# Altium project Time4CM4_Modular.PrjPcb
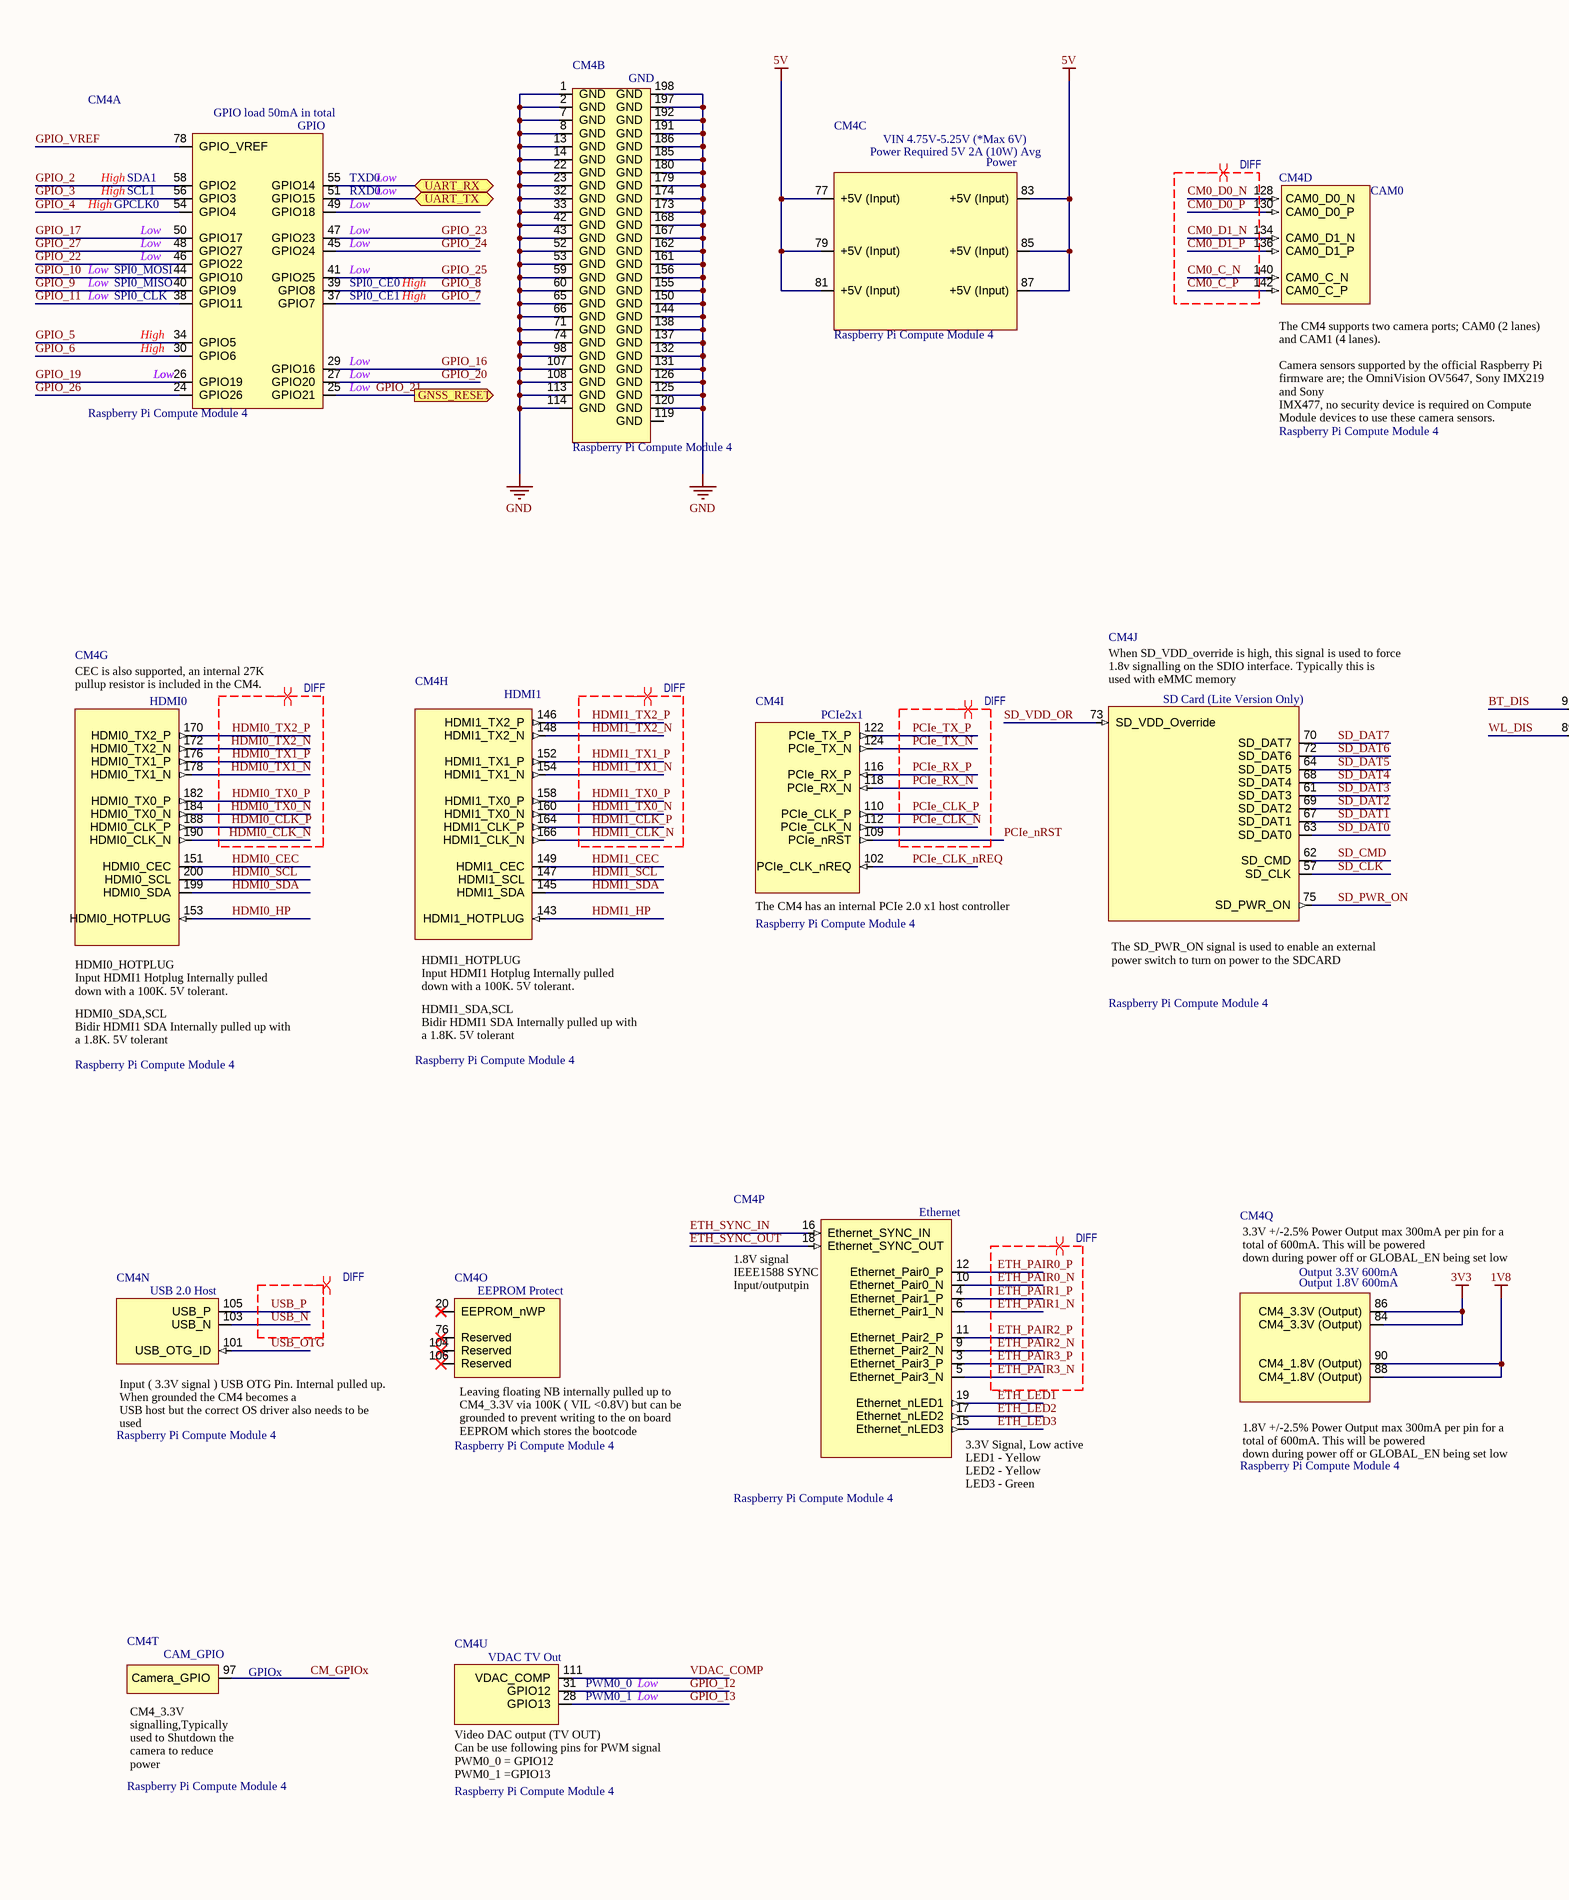
[diagram p0: CM4_Conn.SchDoc, left]
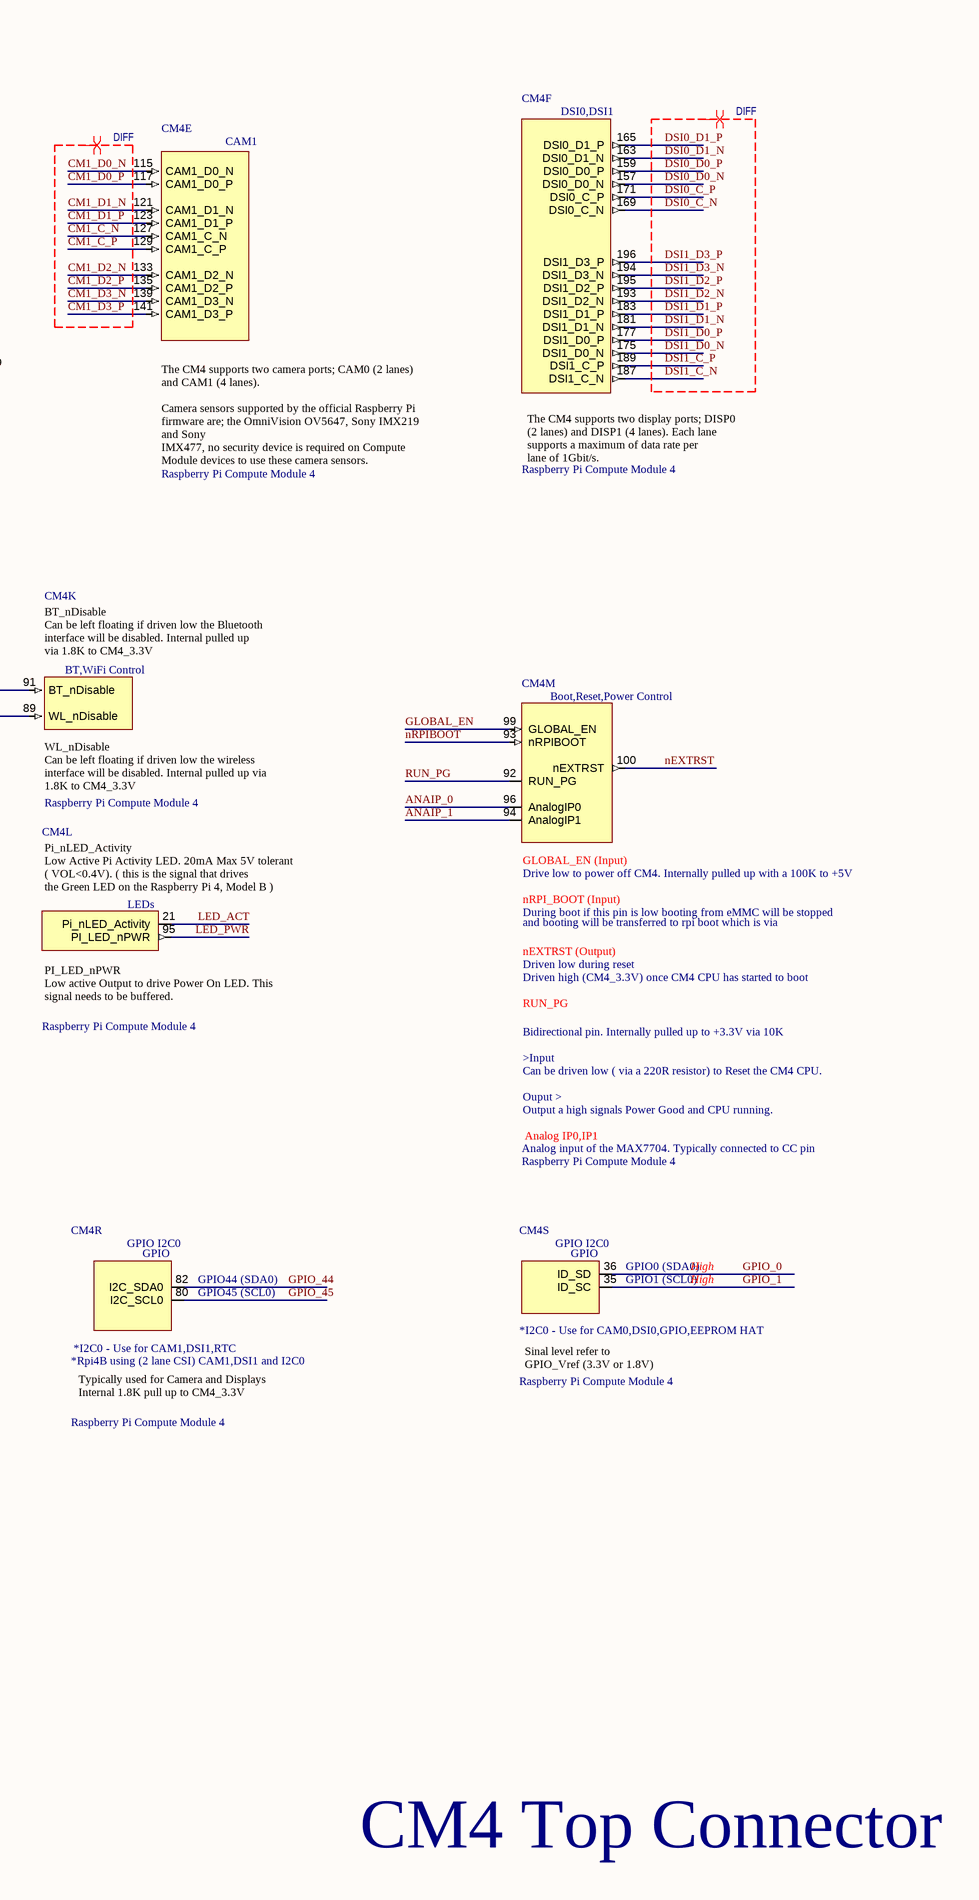
[diagram p1: CM4_Conn.SchDoc, right]
4 sheets, 35 parts. Net scope: global (net labels, ports and power ports of the same name join across sheets).
Board file: Time4CM4_Modular.PcbDoc
Sheets:
  CM4_Conn.SchDoc
  CM4_IO_Conn.SchDoc
  Modular_BO.SchDoc
  GNSS.SchDoc

## Sheet CM4_Conn.SchDoc
size C; SheetNumber: 1; SheetTotal: 4

### Parts
CM4  Raspberry Pi Compute Module 4  [CM4-F40C-100DS-0.4v_1.5mm_0mm]  (parts A,B,C,D,E,F,G,H,I,J,K,L,M,N,O,P,Q,R,S,T,U of 21)  (no BOM)

### Ports
GNSS_RESET (out), UART_RX (bidir), UART_TX (bidir)

### Nets
1V8: CM4.88(CM4_1.8V_(Output)) CM4.90(CM4_1.8V_(Output))
3V3: CM4.84(CM4_3.3V_(Output)) CM4.86(CM4_3.3V_(Output))
5V: CM4.77(+5V_(Input)) CM4.79(+5V_(Input)) CM4.81(+5V_(Input)) CM4.83(+5V_(Input)) CM4.85(+5V_(Input)) CM4.87(+5V_(Input))
GND: CM4.1(GND) CM4.2(GND) CM4.7(GND) CM4.8(GND) CM4.13(GND) CM4.14(GND) CM4.22(GND) CM4.23(GND) CM4.32(GND) CM4.33(GND) CM4.42(GND) CM4.43(GND) CM4.52(GND) CM4.53(GND) CM4.59(GND) CM4.60(GND) CM4.65(GND) CM4.66(GND) CM4.71(GND) CM4.74(GND) CM4.98(GND) CM4.107(GND) CM4.108(GND) CM4.113(GND) CM4.114(GND) CM4.120(GND) CM4.125(GND) CM4.126(GND) CM4.131(GND) CM4.132(GND) CM4.137(GND) CM4.138(GND) CM4.144(GND) CM4.150(GND) CM4.155(GND) CM4.156(GND) CM4.161(GND) CM4.162(GND) CM4.167(GND) CM4.168(GND) CM4.173(GND) CM4.174(GND) CM4.179(GND) CM4.180(GND) CM4.185(GND) CM4.186(GND) CM4.191(GND) CM4.192(GND) CM4.197(GND) CM4.198(GND)
ANAIP_0: CM4.96(AnalogIP0)
ANAIP_1: CM4.94(AnalogIP1)
BT_DIS: CM4.91(BT_nDisable)
CM0_C_N: CM4.140(CAM0_C_N)
CM0_C_P: CM4.142(CAM0_C_P)
CM0_D0_N: CM4.128(CAM0_D0_N)
CM0_D0_P: CM4.130(CAM0_D0_P)
CM0_D1_N: CM4.134(CAM0_D1_N)
CM0_D1_P: CM4.136(CAM0_D1_P)
CM1_C_N: CM4.127(CAM1_C_N)
CM1_C_P: CM4.129(CAM1_C_P)
CM1_D0_N: CM4.115(CAM1_D0_N)
CM1_D0_P: CM4.117(CAM1_D0_P)
CM1_D1_N: CM4.121(CAM1_D1_N)
CM1_D1_P: CM4.123(CAM1_D1_P)
CM1_D2_N: CM4.133(CAM1_D2_N)
CM1_D2_P: CM4.135(CAM1_D2_P)
CM1_D3_N: CM4.139(CAM1_D3_N)
CM1_D3_P: CM4.141(CAM1_D3_P)
CM_GPIOx: CM4.97(Camera_GPIO)
DSI0_C_N: CM4.169(DSI0_C_N)
DSI0_C_P: CM4.171(DSI0_C_P)
DSI0_D0_N: CM4.157(DSI0_D0_N)
DSI0_D0_P: CM4.159(DSI0_D0_P)
DSI0_D1_N: CM4.163(DSI0_D1_N)
DSI0_D1_P: CM4.165(DSI0_D1_P)
DSI1_C_N: CM4.187(DSI1_C_N)
DSI1_C_P: CM4.189(DSI1_C_P)
DSI1_D0_N: CM4.175(DSI1_D0_N)
DSI1_D0_P: CM4.177(DSI1_D0_P)
DSI1_D1_N: CM4.181(DSI1_D1_N)
DSI1_D1_P: CM4.183(DSI1_D1_P)
DSI1_D2_N: CM4.193(DSI1_D2_N)
DSI1_D2_P: CM4.195(DSI1_D2_P)
DSI1_D3_N: CM4.194(DSI1_D3_N)
DSI1_D3_P: CM4.196(DSI1_D3_P)
ETH_LED1: CM4.19(Ethernet_nLED1)
ETH_LED2: CM4.17(Ethernet_nLED2)
ETH_LED3: CM4.15(Ethernet_nLED3)
ETH_PAIR0_N: CM4.10(Ethernet_Pair0_N)
ETH_PAIR0_P: CM4.12(Ethernet_Pair0_P)
ETH_PAIR1_N: CM4.6(Ethernet_Pair1_N)
ETH_PAIR1_P: CM4.4(Ethernet_Pair1_P)
ETH_PAIR2_N: CM4.9(Ethernet_Pair2_N)
ETH_PAIR2_P: CM4.11(Ethernet_Pair2_P)
ETH_PAIR3_N: CM4.5(Ethernet_Pair3_N)
ETH_PAIR3_P: CM4.3(Ethernet_Pair3_P)
ETH_SYNC_IN: CM4.16(Ethernet_SYNC_IN)
ETH_SYNC_OUT: CM4.18(Ethernet_SYNC_OUT)
GLOBAL_EN: CM4.99(GLOBAL_EN)
GPIO_0: CM4.36(ID_SD)
GPIO_1: CM4.35(ID_SC)
GPIO_2: CM4.58(GPIO2)
GPIO_3: CM4.56(GPIO3)
GPIO_4: CM4.54(GPIO4)
GPIO_5: CM4.34(GPIO5)
GPIO_6: CM4.30(GPIO6)
GPIO_7: CM4.37(GPIO7)
GPIO_8: CM4.39(GPIO8)
GPIO_9: CM4.40(GPIO9)
GPIO_10: CM4.44(GPIO10)
GPIO_11: CM4.38(GPIO11)
GPIO_12: CM4.31(GPIO12)
GPIO_13: CM4.28(GPIO13)
GPIO_16: CM4.29(GPIO16)
GPIO_17: CM4.50(GPIO17)
GPIO_19: CM4.26(GPIO19)
GPIO_20: CM4.27(GPIO20)
GPIO_21: CM4.25(GPIO21) ; port GNSS_RESET  [project net GNSS_RESET]
GPIO_22: CM4.46(GPIO22)
GPIO_23: CM4.47(GPIO23)
GPIO_24: CM4.45(GPIO24)
GPIO_25: CM4.41(GPIO25)
GPIO_26: CM4.24(GPIO26)
GPIO_27: CM4.48(GPIO27)
GPIO_44: CM4.82(I2C_SDA0)
GPIO_45: CM4.80(I2C_SCL0)
GPIO_VREF: CM4.78(GPIO_VREF)
HDMI0_CEC: CM4.151(HDMI0_CEC)
HDMI0_CLK_N: CM4.190(HDMI0_CLK_N)
HDMI0_CLK_P: CM4.188(HDMI0_CLK_P)
HDMI0_HP: CM4.153(HDMI0_HOTPLUG)
HDMI0_SCL: CM4.200(HDMI0_SCL)
HDMI0_SDA: CM4.199(HDMI0_SDA)
HDMI0_TX0_N: CM4.184(HDMI0_TX0_N)
HDMI0_TX0_P: CM4.182(HDMI0_TX0_P)
HDMI0_TX1_N: CM4.178(HDMI0_TX1_N)
HDMI0_TX1_P: CM4.176(HDMI0_TX1_P)
HDMI0_TX2_N: CM4.172(HDMI0_TX2_N)
HDMI0_TX2_P: CM4.170(HDMI0_TX2_P)
HDMI1_CEC: CM4.149(HDMI1_CEC)
HDMI1_CLK_N: CM4.166(HDMI1_CLK_N)
HDMI1_CLK_P: CM4.164(HDMI1_CLK_P)
HDMI1_HP: CM4.143(HDMI1_HOTPLUG)
HDMI1_SCL: CM4.147(HDMI1_SCL)
HDMI1_SDA: CM4.145(HDMI1_SDA)
HDMI1_TX0_N: CM4.160(HDMI1_TX0_N)
HDMI1_TX0_P: CM4.158(HDMI1_TX0_P)
HDMI1_TX1_N: CM4.154(HDMI1_TX1_N)
HDMI1_TX1_P: CM4.152(HDMI1_TX1_P)
HDMI1_TX2_N: CM4.148(HDMI1_TX2_N)
HDMI1_TX2_P: CM4.146(HDMI1_TX2_P)
LED_ACT: CM4.21(Pi_nLED_Activity)
LED_PWR: CM4.95(PI_LED_nPWR)
nEXTRST: CM4.100(nEXTRST)
nRPIBOOT: CM4.93(nRPIBOOT)
PCIe_CLK_N: CM4.112(PCIe_CLK_N)
PCIe_CLK_nREQ: CM4.102(PCIe_CLK_nREQ)
PCIe_CLK_P: CM4.110(PCIe_CLK_P)
PCIe_nRST: CM4.109(PCIe_nRST)
PCIe_RX_N: CM4.118(PCIe_RX_N)
PCIe_RX_P: CM4.116(PCIe_RX_P)
PCIe_TX_N: CM4.124(PCIe_TX_N)
PCIe_TX_P: CM4.122(PCIe_TX_P)
RUN_PG: CM4.92(RUN_PG)
SD_CLK: CM4.57(SD_CLK)
SD_CMD: CM4.62(SD_CMD)
SD_DAT0: CM4.63(SD_DAT0)
SD_DAT1: CM4.67(SD_DAT1)
SD_DAT2: CM4.69(SD_DAT2)
SD_DAT3: CM4.61(SD_DAT3)
SD_DAT4: CM4.68(SD_DAT4)
SD_DAT5: CM4.64(SD_DAT5)
SD_DAT6: CM4.72(SD_DAT6)
SD_DAT7: CM4.70(SD_DAT7)
SD_PWR_ON: CM4.75(SD_PWR_ON)
SD_VDD_OR: CM4.73(SD_VDD_Override)
UART_RX: CM4.55(GPIO14) ; port UART_RX
UART_TX: CM4.51(GPIO15) ; port UART_TX
USB_N: CM4.103(USB_N)
USB_OTG: CM4.101(USB_OTG_ID)
USB_P: CM4.105(USB_P)
VDAC_COMP: CM4.111(VDAC_COMP)
WL_DIS: CM4.89(WL_nDisable)

Not connected (* = marked no-connect by the designer): CM4 20(EEPROM_nWP)* 49(GPIO18) 76(Reserved)* 104(Reserved)* 106(Reserved)* 119(GND)

### Layout directives
differential pair; differential pair class DIFF: CM0_C_N, CM0_C_P, CM0_D0_N, CM0_D0_P, CM0_D1_N, CM0_D1_P, CM1_C_N, CM1_C_P, CM1_D0_N, CM1_D0_P, CM1_D1_N, CM1_D1_P, CM1_D2_N, CM1_D2_P, CM1_D3_N, CM1_D3_P, DSI0_C_N, DSI0_C_P, DSI0_D0_N, DSI0_D0_P, DSI0_D1_N, DSI0_D1_P, DSI1_C_N, DSI1_C_P, DSI1_D0_N, DSI1_D0_P, DSI1_D1_N, DSI1_D1_P, DSI1_D2_N, DSI1_D2_P, DSI1_D3_N, DSI1_D3_P, ETH_PAIR0_N, ETH_PAIR0_P, ETH_PAIR1_N, ETH_PAIR1_P, ETH_PAIR2_N, ETH_PAIR2_P, ETH_PAIR3_N, ETH_PAIR3_P, HDMI0_CLK_N, HDMI0_CLK_P, HDMI0_TX0_N, HDMI0_TX0_P, HDMI0_TX1_N, HDMI0_TX1_P, HDMI0_TX2_N, HDMI0_TX2_P, HDMI1_CLK_N, HDMI1_CLK_P, HDMI1_TX0_N, HDMI1_TX0_P, HDMI1_TX1_N, HDMI1_TX1_P, HDMI1_TX2_N, HDMI1_TX2_P, PCIe_CLK_N, PCIe_CLK_P, PCIe_RX_N, PCIe_RX_P, PCIe_TX_N, PCIe_TX_P, USB_N, USB_P

### Notes on the sheet
- CM4 Top Connector
- DWG. NO.
- REV.
- SHT.
- REVISION
- DESCRIPTION
- DATE
- APPROVED
- THIS DOCUMENT AND THE DATA DISCLOSED HEREIN OR HEREWITH IS THE PROPERTY OF ALTIUM LIMITED AND MAY BE FREELY DISTRIBUTED IN WHOLE. NO RIGHTS ARE RESERVED OR EXPRESS OR IMPLIED WARANTEE GIVEN.
- ENG:
- DSN:
- APPROVALS
- PROJECT
- DOCUMENT REVISION:
- DESIGN ITEM:
- CHK:
- BOM:
- REFERENCE DOCUMENTS
- PROJECT REVISION:
- TITLE
- FAB DWG:
- PCB DWG:
- ASSY DWG:
- SCALE:
- SIZE
- C
- CAGE CODE
- FILE NAME
- DWG NO.
- SHEET
- OF
- REV
- (in symbol CM4, part A) GPIO load 50mA in total; GPIO; High; SDA1; TXD0; Low; SCL1; RXD0; GPCLK0; SPI0_MOSI; SPI0_MISO; SPI0_CE0; SPI0_CLK; SPI0_CE1; by Amornthep Phunsin
- (in symbol CM4, part C) VIN 4.75V-5.25V (*Max 6V); Power Required 5V 2A (10W) Avg; Power; by Amornthep Phunsin
- (in symbol CM4, part D) CAM0; The CM4 supports two camera ports; CAM0 (2 lanes) and CAM1 (4 lanes). / Camera sensors supported by the official Raspberry Pi firmware are; the OmniVision OV5647, Sony IMX219 and Sony / IMX477, no security device is required on Compute Module devices to use these camera sensors.
- (in symbol CM4, part E) CAM1; The CM4 supports two camera ports; CAM0 (2 lanes) and CAM1 (4 lanes). / Camera sensors supported by the official Raspberry Pi firmware are; the OmniVision OV5647, Sony IMX219 and Sony / IMX477, no security device is required on Compute Module devices to use these camera sensors.
- (in symbol CM4, part F) DSI0,DSI1; The CM4 supports two display ports; DISP0 (2 lanes) and DISP1 (4 lanes). Each lane supports a maximum of data rate per / lane of 1Gbit/s.
- (in symbol CM4, part G) HDMI0; CEC is also supported, an internal 27K pullup resistor is included in the CM4.; HDMI0_HOTPLUG / Input HDMI1 Hotplug Internally pulled down with a 100K. 5V tolerant.; HDMI0_SDA,SCL / Bidir HDMI1 SDA Internally pulled up with a 1.8K. 5V tolerant
- (in symbol CM4, part H) HDMI1; HDMI1_HOTPLUG / Input HDMI1 Hotplug Internally pulled down with a 100K. 5V tolerant.; HDMI1_SDA,SCL / Bidir HDMI1 SDA Internally pulled up with a 1.8K. 5V tolerant
- (in symbol CM4, part I) PCIe2x1; The CM4 has an internal PCIe 2.0 x1 host controller
- (in symbol CM4, part J) When SD_VDD_override is high, this signal is used to force 1.8v signalling on the SDIO interface. Typically this is / used with eMMC memory; SD Card (Lite Version Only); by Amornthep Phunsin; The SD_PWR_ON signal is used to enable an external power switch to turn on power to the SDCARD
- (in symbol CM4, part K) BT_nDisable / Can be left floating if driven low the Bluetooth interface will be disabled. Internal pulled up / via 1.8K to CM4_3.3V; BT,WiFi Control; WL_nDisable / Can be left floating if driven low the wireless interface will be disabled. Internal pulled up via / 1.8K to CM4_3.3V
- (in symbol CM4, part L) Pi_nLED_Activity / Low Active Pi Activity LED. 20mA Max 5V tolerant ( VOL<0.4V). ( this is the signal that drives / the Green LED on the Raspberry Pi 4, Model B ); LEDs; PI_LED_nPWR / Low active Output to drive Power On LED. This signal needs to be buffered.
- (in symbol CM4, part M) Boot,Reset,Power Control; GLOBAL_EN (Input); Drive low to power off CM4. Internally pulled up with a 100K to +5V; nRPI_BOOT (Input); During boot if this pin is low booting from eMMC will be stopped; and booting will be transferred to rpi boot which is via; nEXTRST (Output); Driven low during reset; Driven high (CM4_3.3V) once CM4 CPU has started to boot; Bidirectional pin. Internally pulled up to +3.3V via 10K / >Input / Can be driven low ( via a 220R resistor) to Reset the CM4 CPU. / Ouput > / Output a high signals Power Good and CPU running.; Analog IP0,IP1; Analog input of the MAX7704. Typically connected to CC pin
- (in symbol CM4, part N) USB 2.0 Host; Input ( 3.3V signal ) USB OTG Pin. Internal pulled up. When grounded the CM4 becomes a / USB host but the correct OS driver also needs to be used
- (in symbol CM4, part O) EEPROM Protect; Leaving floating NB internally pulled up to CM4_3.3V via 100K ( VIL <0.8V) but can be / grounded to prevent writing to the on board EEPROM which stores the bootcode
- (in symbol CM4, part P) Ethernet; 1.8V signal / IEEE1588 SYNC Input/outputpin; by Amornthep Phunsin; 3.3V Signal, Low active / LED1 - Yellow / LED2 - Yellow / LED3 - Green
- (in symbol CM4, part Q) 3.3V +/-2.5% Power Output max 300mA per pin for a total of 600mA. This will be powered / down during power off or GLOBAL_EN being set low; Output 3.3V 600mA; Output 1.8V 600mA; 1.8V +/-2.5% Power Output max 300mA per pin for a total of 600mA. This will be powered / down during power off or GLOBAL_EN being set low
- (in symbol CM4, part R) GPIO I2C0; GPIO; GPIO44 (SDA0); GPIO45 (SCL0); *I2C0 - Use for CAM1,DSI1,RTC; *Rpi4B using (2 lane CSI) CAM1,DSI1 and I2C0; Typically used for Camera and Displays Internal 1.8K pull up to CM4_3.3V
- (in symbol CM4, part S) GPIO I2C0; GPIO; GPIO0 (SDA0); High; GPIO1 (SCL0); *I2C0 - Use for CAM0,DSI0,GPIO,EEPROM HAT; Sinal level refer to  GPIO_Vref (3.3V or 1.8V)
- (in symbol CM4, part T) CAM_GPIO; GPIOx; CM4_3.3V signalling,Typically used to Shutdown the camera to reduce power
- (in symbol CM4, part U) VDAC TV Out; PWM0_0; Low; PWM0_1; Video DAC output (TV OUT) / Can be use following pins for PWM signal / PWM0_0 = GPIO12 / PWM0_1 =GPIO13

### Library data of the parts
CM4 = CM4: Raspberry Pi Compute Module 4 by Amornthep Phunsin

## Sheet CM4_IO_Conn.SchDoc
size C; SheetNumber: 2; SheetTotal: 4
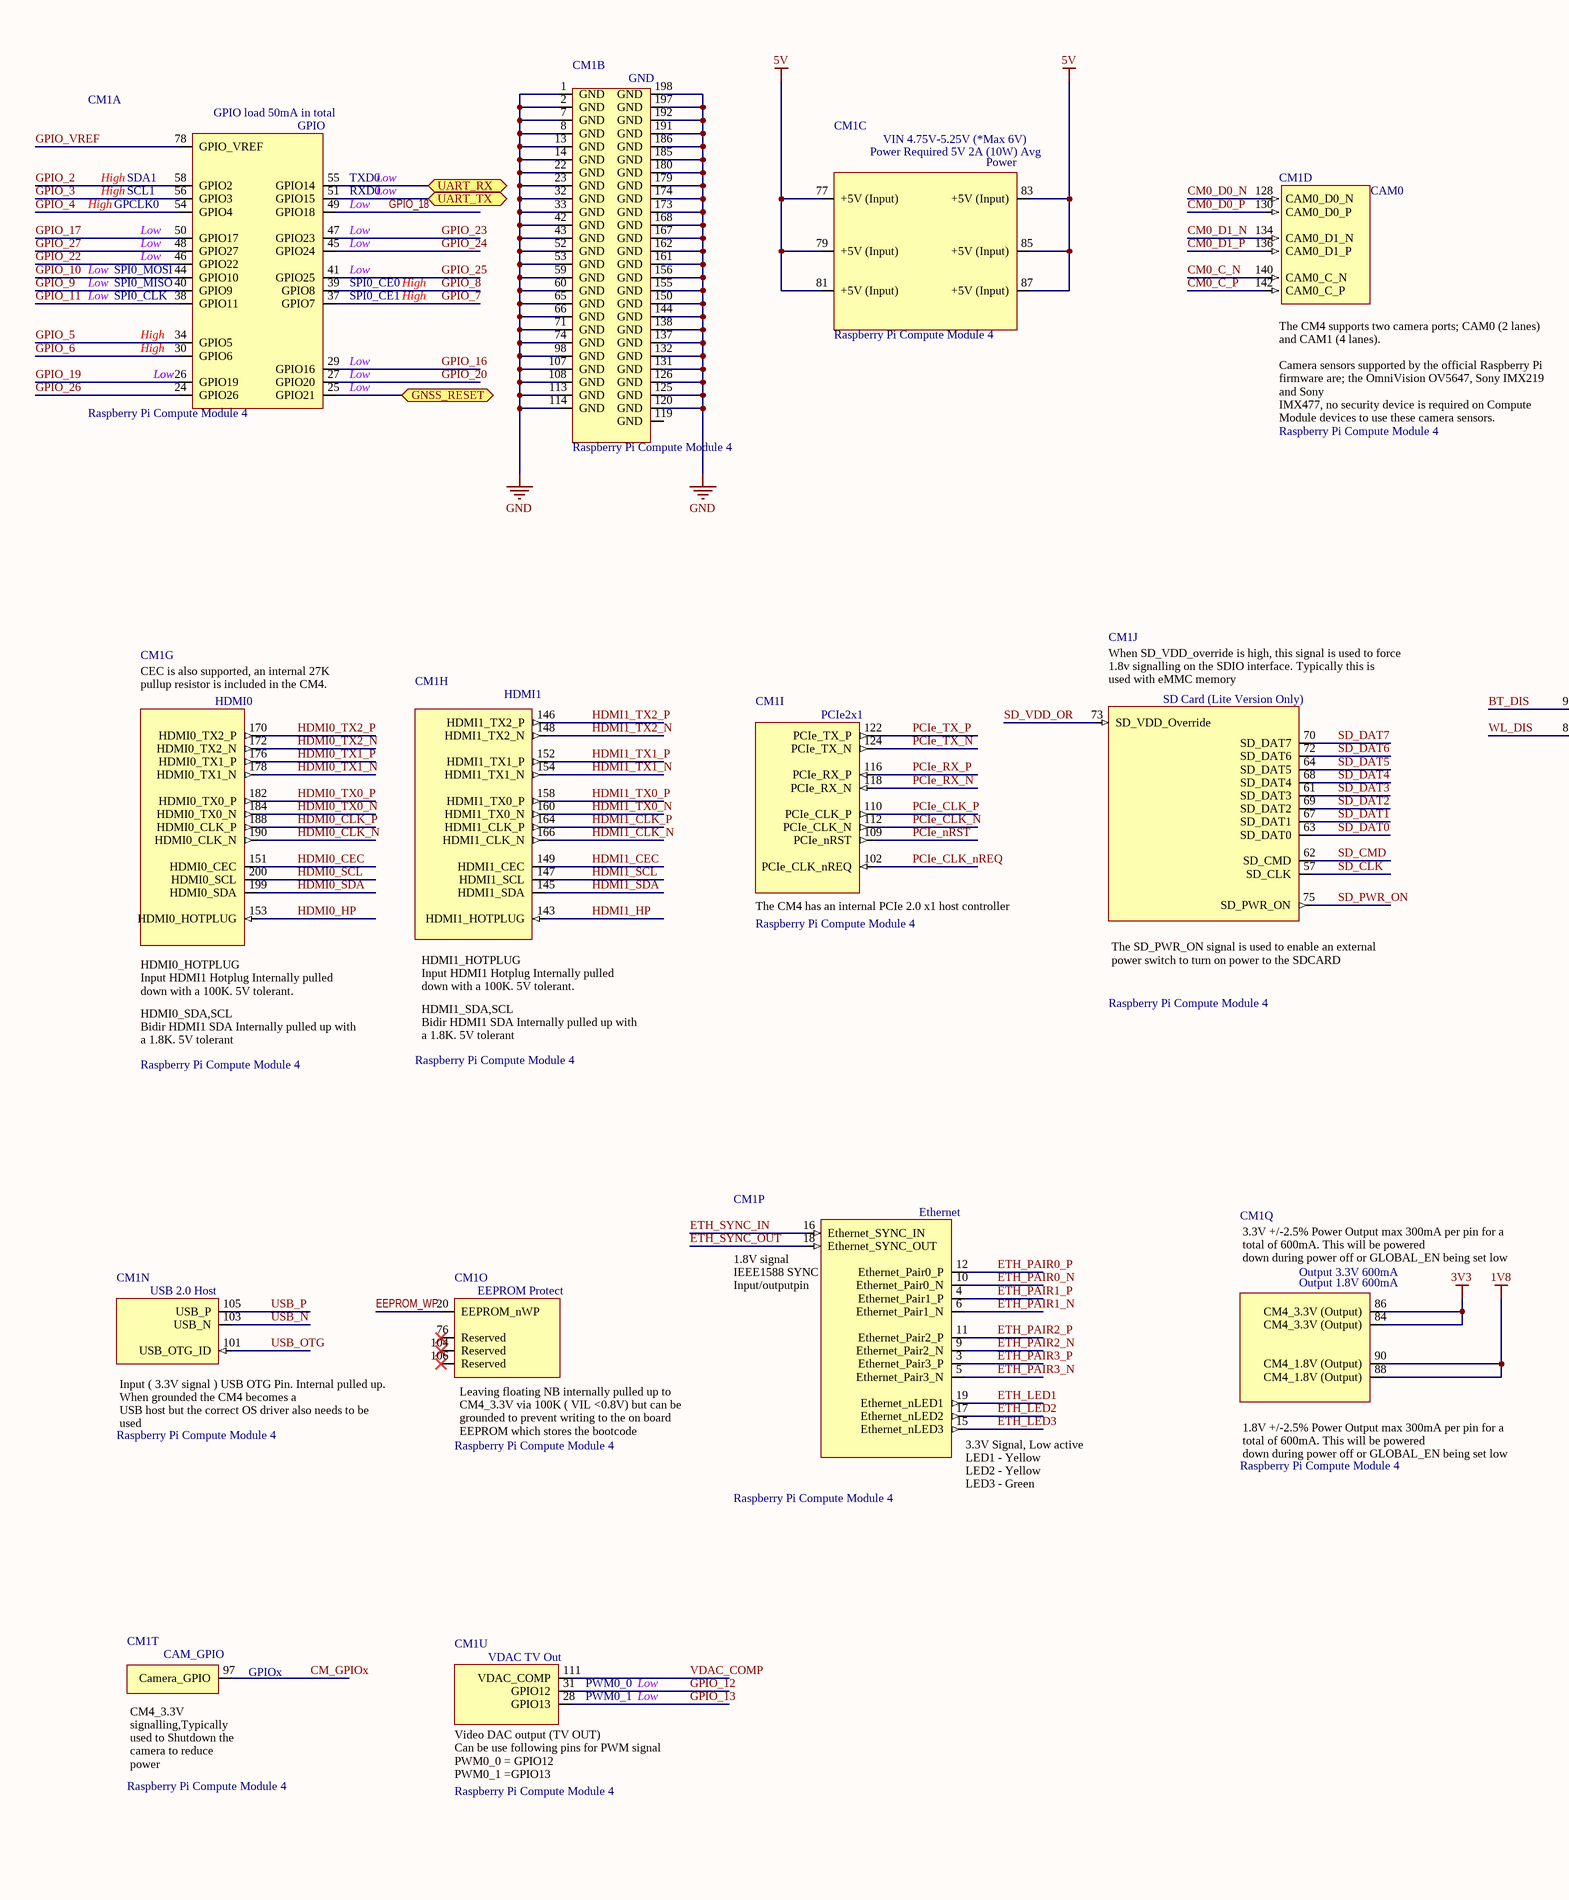
[diagram p2: CM4_IO_Conn.SchDoc, left]
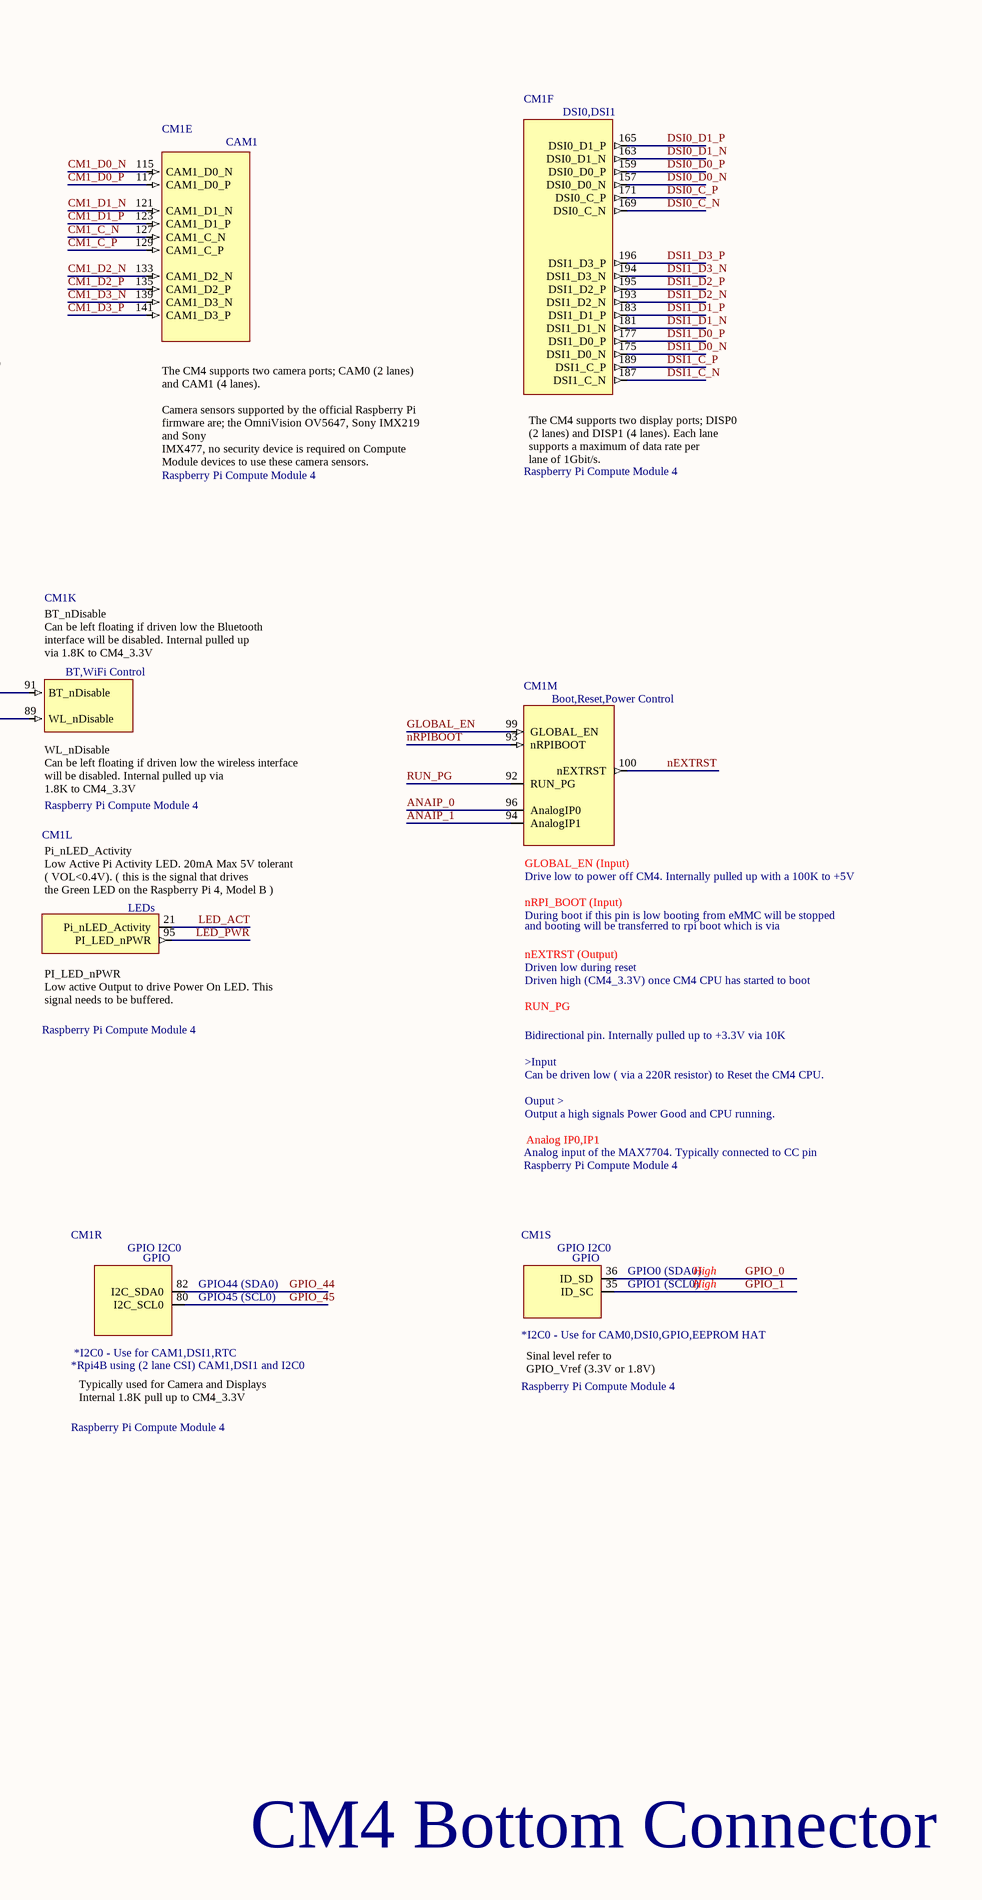
[diagram p3: CM4_IO_Conn.SchDoc, right]

### Parts
CM1  Raspberry Pi Compute Module 4  [CM4-F40C-100DS-0.4v_1.5mm_0mm]  (parts A,B,C,D,E,F,G,H,I,J,K,L,M,N,O,P,Q,R,S,T,U of 21)  (no BOM)

### Ports
GNSS_RESET (bidir), UART_RX (bidir), UART_TX (bidir)

### Nets
1V8: CM1.88(CM4_1.8V_(Output)) CM1.90(CM4_1.8V_(Output))
3V3: CM1.84(CM4_3.3V_(Output)) CM1.86(CM4_3.3V_(Output))
5V: CM1.77(+5V_(Input)) CM1.79(+5V_(Input)) CM1.81(+5V_(Input)) CM1.83(+5V_(Input)) CM1.85(+5V_(Input)) CM1.87(+5V_(Input))
GND: CM1.1(GND) CM1.2(GND) CM1.7(GND) CM1.8(GND) CM1.13(GND) CM1.14(GND) CM1.22(GND) CM1.23(GND) CM1.32(GND) CM1.33(GND) CM1.42(GND) CM1.43(GND) CM1.52(GND) CM1.53(GND) CM1.59(GND) CM1.60(GND) CM1.65(GND) CM1.66(GND) CM1.71(GND) CM1.74(GND) CM1.98(GND) CM1.107(GND) CM1.108(GND) CM1.113(GND) CM1.114(GND) CM1.120(GND) CM1.125(GND) CM1.126(GND) CM1.131(GND) CM1.132(GND) CM1.137(GND) CM1.138(GND) CM1.144(GND) CM1.150(GND) CM1.155(GND) CM1.156(GND) CM1.161(GND) CM1.162(GND) CM1.167(GND) CM1.168(GND) CM1.173(GND) CM1.174(GND) CM1.179(GND) CM1.180(GND) CM1.185(GND) CM1.186(GND) CM1.191(GND) CM1.192(GND) CM1.197(GND) CM1.198(GND)
ANAIP_0: CM1.96(AnalogIP0)
ANAIP_1: CM1.94(AnalogIP1)
BT_DIS: CM1.91(BT_nDisable)
CM0_C_N: CM1.140(CAM0_C_N)
CM0_C_P: CM1.142(CAM0_C_P)
CM0_D0_N: CM1.128(CAM0_D0_N)
CM0_D0_P: CM1.130(CAM0_D0_P)
CM0_D1_N: CM1.134(CAM0_D1_N)
CM0_D1_P: CM1.136(CAM0_D1_P)
CM1_C_N: CM1.127(CAM1_C_N)
CM1_C_P: CM1.129(CAM1_C_P)
CM1_D0_N: CM1.115(CAM1_D0_N)
CM1_D0_P: CM1.117(CAM1_D0_P)
CM1_D1_N: CM1.121(CAM1_D1_N)
CM1_D1_P: CM1.123(CAM1_D1_P)
CM1_D2_N: CM1.133(CAM1_D2_N)
CM1_D2_P: CM1.135(CAM1_D2_P)
CM1_D3_N: CM1.139(CAM1_D3_N)
CM1_D3_P: CM1.141(CAM1_D3_P)
CM_GPIOx: CM1.97(Camera_GPIO)
DSI0_C_N: CM1.169(DSI0_C_N)
DSI0_C_P: CM1.171(DSI0_C_P)
DSI0_D0_N: CM1.157(DSI0_D0_N)
DSI0_D0_P: CM1.159(DSI0_D0_P)
DSI0_D1_N: CM1.163(DSI0_D1_N)
DSI0_D1_P: CM1.165(DSI0_D1_P)
DSI1_C_N: CM1.187(DSI1_C_N)
DSI1_C_P: CM1.189(DSI1_C_P)
DSI1_D0_N: CM1.175(DSI1_D0_N)
DSI1_D0_P: CM1.177(DSI1_D0_P)
DSI1_D1_N: CM1.181(DSI1_D1_N)
DSI1_D1_P: CM1.183(DSI1_D1_P)
DSI1_D2_N: CM1.193(DSI1_D2_N)
DSI1_D2_P: CM1.195(DSI1_D2_P)
DSI1_D3_N: CM1.194(DSI1_D3_N)
DSI1_D3_P: CM1.196(DSI1_D3_P)
EEPROM_WP: CM1.20(EEPROM_nWP)
ETH_LED1: CM1.19(Ethernet_nLED1)
ETH_LED2: CM1.17(Ethernet_nLED2)
ETH_LED3: CM1.15(Ethernet_nLED3)
ETH_PAIR0_N: CM1.10(Ethernet_Pair0_N)
ETH_PAIR0_P: CM1.12(Ethernet_Pair0_P)
ETH_PAIR1_N: CM1.6(Ethernet_Pair1_N)
ETH_PAIR1_P: CM1.4(Ethernet_Pair1_P)
ETH_PAIR2_N: CM1.9(Ethernet_Pair2_N)
ETH_PAIR2_P: CM1.11(Ethernet_Pair2_P)
ETH_PAIR3_N: CM1.5(Ethernet_Pair3_N)
ETH_PAIR3_P: CM1.3(Ethernet_Pair3_P)
ETH_SYNC_IN: CM1.16(Ethernet_SYNC_IN)
ETH_SYNC_OUT: CM1.18(Ethernet_SYNC_OUT)
GLOBAL_EN: CM1.99(GLOBAL_EN)
GNSS_RESET: CM1.25(GPIO21) ; port GNSS_RESET
GPIO_0: CM1.36(ID_SD)
GPIO_1: CM1.35(ID_SC)
GPIO_2: CM1.58(GPIO2)
GPIO_3: CM1.56(GPIO3)
GPIO_4: CM1.54(GPIO4)
GPIO_5: CM1.34(GPIO5)
GPIO_6: CM1.30(GPIO6)
GPIO_7: CM1.37(GPIO7)
GPIO_8: CM1.39(GPIO8)
GPIO_9: CM1.40(GPIO9)
GPIO_10: CM1.44(GPIO10)
GPIO_11: CM1.38(GPIO11)
GPIO_12: CM1.31(GPIO12)
GPIO_13: CM1.28(GPIO13)
GPIO_16: CM1.29(GPIO16)
GPIO_17: CM1.50(GPIO17)
GPIO_18: CM1.49(GPIO18)
GPIO_19: CM1.26(GPIO19)
GPIO_20: CM1.27(GPIO20)
GPIO_22: CM1.46(GPIO22)
GPIO_23: CM1.47(GPIO23)
GPIO_24: CM1.45(GPIO24)
GPIO_25: CM1.41(GPIO25)
GPIO_26: CM1.24(GPIO26)
GPIO_27: CM1.48(GPIO27)
GPIO_44: CM1.82(I2C_SDA0)
GPIO_45: CM1.80(I2C_SCL0)
GPIO_VREF: CM1.78(GPIO_VREF)
HDMI0_CEC: CM1.151(HDMI0_CEC)
HDMI0_CLK_N: CM1.190(HDMI0_CLK_N)
HDMI0_CLK_P: CM1.188(HDMI0_CLK_P)
HDMI0_HP: CM1.153(HDMI0_HOTPLUG)
HDMI0_SCL: CM1.200(HDMI0_SCL)
HDMI0_SDA: CM1.199(HDMI0_SDA)
HDMI0_TX0_N: CM1.184(HDMI0_TX0_N)
HDMI0_TX0_P: CM1.182(HDMI0_TX0_P)
HDMI0_TX1_N: CM1.178(HDMI0_TX1_N)
HDMI0_TX1_P: CM1.176(HDMI0_TX1_P)
HDMI0_TX2_N: CM1.172(HDMI0_TX2_N)
HDMI0_TX2_P: CM1.170(HDMI0_TX2_P)
HDMI1_CEC: CM1.149(HDMI1_CEC)
HDMI1_CLK_N: CM1.166(HDMI1_CLK_N)
HDMI1_CLK_P: CM1.164(HDMI1_CLK_P)
HDMI1_HP: CM1.143(HDMI1_HOTPLUG)
HDMI1_SCL: CM1.147(HDMI1_SCL)
HDMI1_SDA: CM1.145(HDMI1_SDA)
HDMI1_TX0_N: CM1.160(HDMI1_TX0_N)
HDMI1_TX0_P: CM1.158(HDMI1_TX0_P)
HDMI1_TX1_N: CM1.154(HDMI1_TX1_N)
HDMI1_TX1_P: CM1.152(HDMI1_TX1_P)
HDMI1_TX2_N: CM1.148(HDMI1_TX2_N)
HDMI1_TX2_P: CM1.146(HDMI1_TX2_P)
LED_ACT: CM1.21(Pi_nLED_Activity)
LED_PWR: CM1.95(PI_LED_nPWR)
nEXTRST: CM1.100(nEXTRST)
nRPIBOOT: CM1.93(nRPIBOOT)
PCIe_CLK_N: CM1.112(PCIe_CLK_N)
PCIe_CLK_nREQ: CM1.102(PCIe_CLK_nREQ)
PCIe_CLK_P: CM1.110(PCIe_CLK_P)
PCIe_nRST: CM1.109(PCIe_nRST)
PCIe_RX_N: CM1.118(PCIe_RX_N)
PCIe_RX_P: CM1.116(PCIe_RX_P)
PCIe_TX_N: CM1.124(PCIe_TX_N)
PCIe_TX_P: CM1.122(PCIe_TX_P)
RUN_PG: CM1.92(RUN_PG)
SD_CLK: CM1.57(SD_CLK)
SD_CMD: CM1.62(SD_CMD)
SD_DAT0: CM1.63(SD_DAT0)
SD_DAT1: CM1.67(SD_DAT1)
SD_DAT2: CM1.69(SD_DAT2)
SD_DAT3: CM1.61(SD_DAT3)
SD_DAT4: CM1.68(SD_DAT4)
SD_DAT5: CM1.64(SD_DAT5)
SD_DAT6: CM1.72(SD_DAT6)
SD_DAT7: CM1.70(SD_DAT7)
SD_PWR_ON: CM1.75(SD_PWR_ON)
SD_VDD_OR: CM1.73(SD_VDD_Override)
UART_RX: CM1.55(GPIO14) ; port UART_RX
UART_TX: CM1.51(GPIO15) ; port UART_TX
USB_N: CM1.103(USB_N)
USB_OTG: CM1.101(USB_OTG_ID)
USB_P: CM1.105(USB_P)
VDAC_COMP: CM1.111(VDAC_COMP)
WL_DIS: CM1.89(WL_nDisable)

Not connected (* = marked no-connect by the designer): CM1 76(Reserved)* 104(Reserved)* 106(Reserved)* 119(GND)

### Notes on the sheet
- CM4 Bottom Connector
- (in symbol CM4, part A) GPIO load 50mA in total; GPIO; High; SDA1; TXD0; Low; SCL1; RXD0; GPCLK0; SPI0_MOSI; SPI0_MISO; SPI0_CE0; SPI0_CLK; SPI0_CE1; by Amornthep Phunsin
- (in symbol CM4, part C) VIN 4.75V-5.25V (*Max 6V); Power Required 5V 2A (10W) Avg; Power; by Amornthep Phunsin
- (in symbol CM4, part D) CAM0; The CM4 supports two camera ports; CAM0 (2 lanes) and CAM1 (4 lanes). / Camera sensors supported by the official Raspberry Pi firmware are; the OmniVision OV5647, Sony IMX219 and Sony / IMX477, no security device is required on Compute Module devices to use these camera sensors.
- (in symbol CM4, part E) CAM1; The CM4 supports two camera ports; CAM0 (2 lanes) and CAM1 (4 lanes). / Camera sensors supported by the official Raspberry Pi firmware are; the OmniVision OV5647, Sony IMX219 and Sony / IMX477, no security device is required on Compute Module devices to use these camera sensors.
- (in symbol CM4, part F) DSI0,DSI1; The CM4 supports two display ports; DISP0 (2 lanes) and DISP1 (4 lanes). Each lane supports a maximum of data rate per / lane of 1Gbit/s.
- (in symbol CM4, part G) HDMI0; CEC is also supported, an internal 27K pullup resistor is included in the CM4.; HDMI0_HOTPLUG / Input HDMI1 Hotplug Internally pulled down with a 100K. 5V tolerant.; HDMI0_SDA,SCL / Bidir HDMI1 SDA Internally pulled up with a 1.8K. 5V tolerant
- (in symbol CM4, part H) HDMI1; HDMI1_HOTPLUG / Input HDMI1 Hotplug Internally pulled down with a 100K. 5V tolerant.; HDMI1_SDA,SCL / Bidir HDMI1 SDA Internally pulled up with a 1.8K. 5V tolerant
- (in symbol CM4, part I) PCIe2x1; The CM4 has an internal PCIe 2.0 x1 host controller
- (in symbol CM4, part J) When SD_VDD_override is high, this signal is used to force 1.8v signalling on the SDIO interface. Typically this is / used with eMMC memory; SD Card (Lite Version Only); by Amornthep Phunsin; The SD_PWR_ON signal is used to enable an external power switch to turn on power to the SDCARD
- (in symbol CM4, part K) BT_nDisable / Can be left floating if driven low the Bluetooth interface will be disabled. Internal pulled up / via 1.8K to CM4_3.3V; BT,WiFi Control; WL_nDisable / Can be left floating if driven low the wireless interface will be disabled. Internal pulled up via / 1.8K to CM4_3.3V
- (in symbol CM4, part L) Pi_nLED_Activity / Low Active Pi Activity LED. 20mA Max 5V tolerant ( VOL<0.4V). ( this is the signal that drives / the Green LED on the Raspberry Pi 4, Model B ); LEDs; PI_LED_nPWR / Low active Output to drive Power On LED. This signal needs to be buffered.
- (in symbol CM4, part M) Boot,Reset,Power Control; GLOBAL_EN (Input); Drive low to power off CM4. Internally pulled up with a 100K to +5V; nRPI_BOOT (Input); During boot if this pin is low booting from eMMC will be stopped; and booting will be transferred to rpi boot which is via; nEXTRST (Output); Driven low during reset; Driven high (CM4_3.3V) once CM4 CPU has started to boot; Bidirectional pin. Internally pulled up to +3.3V via 10K / >Input / Can be driven low ( via a 220R resistor) to Reset the CM4 CPU. / Ouput > / Output a high signals Power Good and CPU running.; Analog IP0,IP1; Analog input of the MAX7704. Typically connected to CC pin
- (in symbol CM4, part N) USB 2.0 Host; Input ( 3.3V signal ) USB OTG Pin. Internal pulled up. When grounded the CM4 becomes a / USB host but the correct OS driver also needs to be used
- (in symbol CM4, part O) EEPROM Protect; Leaving floating NB internally pulled up to CM4_3.3V via 100K ( VIL <0.8V) but can be / grounded to prevent writing to the on board EEPROM which stores the bootcode
- (in symbol CM4, part P) Ethernet; 1.8V signal / IEEE1588 SYNC Input/outputpin; by Amornthep Phunsin; 3.3V Signal, Low active / LED1 - Yellow / LED2 - Yellow / LED3 - Green
- (in symbol CM4, part Q) 3.3V +/-2.5% Power Output max 300mA per pin for a total of 600mA. This will be powered / down during power off or GLOBAL_EN being set low; Output 3.3V 600mA; Output 1.8V 600mA; 1.8V +/-2.5% Power Output max 300mA per pin for a total of 600mA. This will be powered / down during power off or GLOBAL_EN being set low
- (in symbol CM4, part R) GPIO I2C0; GPIO; GPIO44 (SDA0); GPIO45 (SCL0); *I2C0 - Use for CAM1,DSI1,RTC; *Rpi4B using (2 lane CSI) CAM1,DSI1 and I2C0; Typically used for Camera and Displays Internal 1.8K pull up to CM4_3.3V
- (in symbol CM4, part S) GPIO I2C0; GPIO; GPIO0 (SDA0); High; GPIO1 (SCL0); *I2C0 - Use for CAM0,DSI0,GPIO,EEPROM HAT; Sinal level refer to  GPIO_Vref (3.3V or 1.8V)
- (in symbol CM4, part T) CAM_GPIO; GPIOx; CM4_3.3V signalling,Typically used to Shutdown the camera to reduce power
- (in symbol CM4, part U) VDAC TV Out; PWM0_0; Low; PWM0_1; Video DAC output (TV OUT) / Can be use following pins for PWM signal / PWM0_0 = GPIO12 / PWM0_1 =GPIO13

### Library data of the parts
CM1 = CM4: as CM4 on sheet CM4_Conn

## Sheet Modular_BO.SchDoc
size C; SheetNumber: 3; SheetTotal: 4
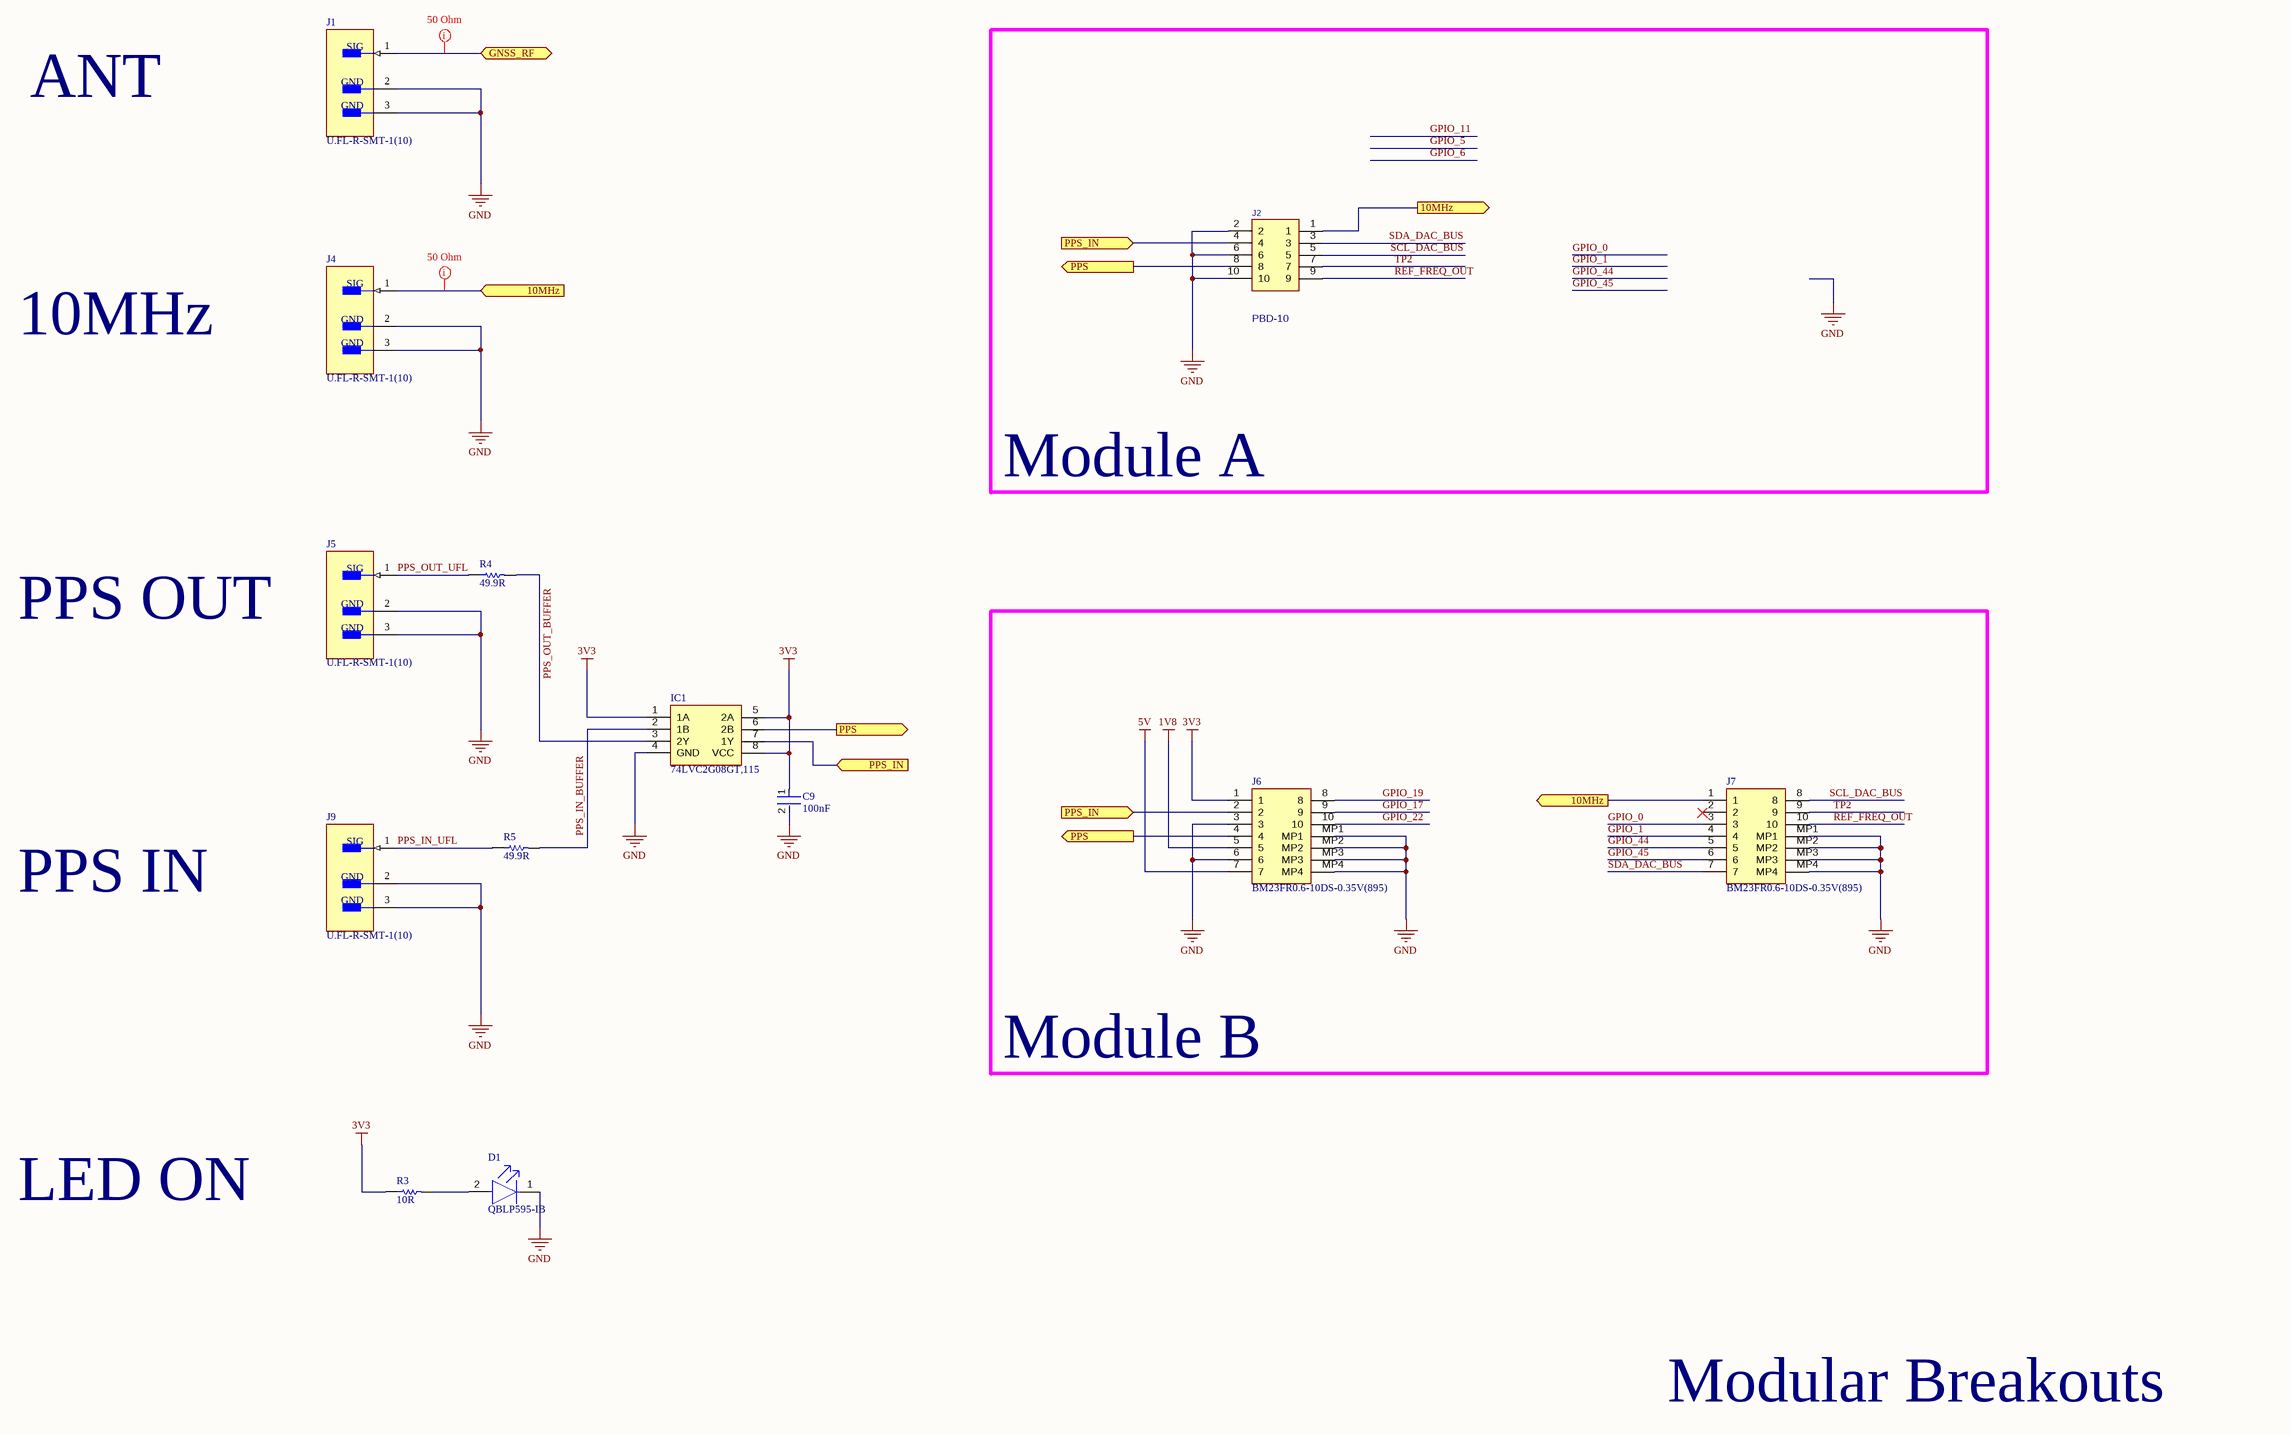
[diagram p4: Modular_BO.SchDoc]

### Parts
C9  100nF  [FP-C0603C-CF-MFG]
D1  QBLP595-IB  [FP-QBLP595-IB-MFG]
IC1  74LVC2G08GT,115  [74AVC9112GTX]
J1  U.FL-R-SMT-1(10)  [FP-U_FL-R-SMT-1_10-MFG]
J2  PBD-10  [PBD-10]
J4  U.FL-R-SMT-1(10)  [FP-U_FL-R-SMT-1_10-MFG]
J5  U.FL-R-SMT-1(10)  [FP-U_FL-R-SMT-1_10-MFG]
J6  BM23FR0.6-10DS-0.35V(895)  [BM23FR0810DS035V895]
J7  BM23FR0.6-10DS-0.35V(895)  [BM23FR0810DS035V895]
J9  U.FL-R-SMT-1(10)  [FP-U_FL-R-SMT-1_10-MFG]
R3  10R  [RESC1005X40X25NL05T10]
R4  49.9R  [RESC1608X55X25NL10T15]
R5  49.9R  [RESC1608X55X25NL10T15]

### Blocks framed on the sheet
Module A: J2
Module B: J6 J7

### Ports
10MHz (in), 10MHz (out), GNSS_RF (bidir), PPS (out), PPS_IN (in)

### Nets
1V8: J6.5
3V3: C9.1 IC1.1(1A) IC1.5(2A) IC1.8(VCC) J6.1 R3.1
5V: J6.7
GND: C9.2 D1.1(C) IC1.4(GND) J1.2(GND) J1.3(GND) J2.2 J2.6 J2.10 J4.2(GND) J4.3(GND) J5.2(GND) J5.3(GND) J6.3 J6.6 J6.MP1 J6.MP2 J6.MP3 J6.MP4 J7.MP1 J7.MP2 J7.MP3 J7.MP4 J9.2(GND) J9.3(GND)
10MHz: J2.1 J4.1(SIG) J7.1 ; port 10MHz
GNSS_RF_IN: J1.1(SIG) ; port GNSS_RF
GPIO_0: J7.3
GPIO_1: J7.4
GPIO_17: J6.9
GPIO_19: J6.8
GPIO_22: J6.10
GPIO_44: J7.5
GPIO_45: J7.6
PPS: IC1.6(2B) J2.8 J6.4 ; port PPS
PPS_IN: IC1.7(1Y) J2.4 J6.2 ; port PPS_IN
PPS_IN_BUFFER: IC1.2(1B) R5.2
PPS_IN_UFL: J9.1(SIG) R5.1
PPS_OUT_BUFFER: IC1.3(2Y) R4.2
PPS_OUT_UFL: J5.1(SIG) R4.1
REF_FREQ_OUT: J2.9 J7.10
SCL_DAC_BUS: J2.5 J7.8
SDA_DAC_BUS: J2.3 J7.7
TP2: J2.7 J7.9
NetD1_2: D1.2(A) R3.2

Not connected (* = marked no-connect by the designer): J7 2*

### Layout directives
net class RF: 10MHz, GNSS_RF_IN

### Notes on the sheet
- ANT
- 10MHz
- PPS OUT
- PPS IN
- LED ON
- Modular Breakouts
- DWG. NO.
- REV.
- SHT.
- REVISION
- DESCRIPTION
- DATE
- APPROVED
- THIS DOCUMENT AND THE DATA DISCLOSED HEREIN OR HEREWITH IS THE PROPERTY OF ALTIUM LIMITED AND MAY BE FREELY DISTRIBUTED IN WHOLE. NO RIGHTS ARE RESERVED OR EXPRESS OR IMPLIED WARANTEE GIVEN.
- ENG:
- DSN:
- APPROVALS
- PROJECT
- DOCUMENT REVISION:
- DESIGN ITEM:
- CHK:
- BOM:
- REFERENCE DOCUMENTS
- PROJECT REVISION:
- TITLE
- FAB DWG:
- PCB DWG:
- ASSY DWG:
- SCALE:
- SIZE
- C
- CAGE CODE
- FILE NAME
- DWG NO.
- SHEET
- OF
- REV

### Library data of the parts
C9 = CMP-2006-03068-2: CAP CER 0.1UF 50V 20% X7R 0603; Manufacturer Part Number: C0603C104M5RACTU; Manufacturer: KEMET; Material: Ceramic; Tolerance: 0.2; Value: 0.10 μF; Temperature Coefficient: 30ppm/°C; Automotive Grade: Grade 1; Temperature Range High: +125°C; Voltage Rating: 50 V; Device Class L3: Ceramic Capacitors; Height: 0.87mm; Category: Cap; RoHS: TRUE; Digikey Description: CAP CER 0.1UF 50V 20% X7R 0603; ComponentLink2URL: https://api.kemet.com/component-edge/download/datasheet/C0603C100J5GACAUTO.pdf; Lead Free: Yes; Temperature Range Low: -55°C; Device Class L1: Passive Components; ComponentLink2Description: Datasheet; Temperature Characteristic: X7R; Automotive: Yes; Temperature: -55°C to +125°C; Octopart: https://octopart.com/c0603c104m5ractu-kemet-11855687; Device Class L2: Capacitors; Package: C0603C-CF; Mouser Description: Multilayer Ceramic Capacitors MLCC - SMD/SMT 50volts 0.1uF X7R 20%; Capacitance: 0.10 μF
D1 = CMP-113271-000002-1: LED BLUE CLEAR 0402 SMD; Lens Size: 0.5mm; Dominant Wavelength: 465nm; Forward Voltage: 3.1V; Lens Color: Colorless; Luminous Intensity: 85mcd; Test Current: 20mA; Viewing Angle: 140°; Lens Style: Flat; Width: 0.5mm; Case Code (Metric): 1005; Lens Transparency: Clear; Color: Blue; Packaging: Tape and Reel; Case Code (Imperial): 0402; Mount: Surface Mount; Length: 1mm; Case/Package: 0402; Height: 0.6mm
IC1 = 74LVC2G08GT,115: Integrated Circuit; Manufacturer_Name: Nexperia; Datasheet Link: https://assets.nexperia.com/documents/data-sheet/74LVC2G08.pdf; Height: 0.5mm; Manufacturer_Part_Number: 74LVC2G08GT,115; Mouser Part Number: 771-LVC2G08GT115; Mouser Price/Stock: https://www.mouser.co.uk/ProductDetail/Nexperia/74LVC2G08GT115?qs=me8TqzrmIYX6ucYoPcZnUg%3D%3D; Arrow Part Number: 74LVC2G08GT,115; Arrow Price/Stock: https://www.arrow.com/en/products/74lvc2g08gt115/nexperia?region=europe
J1 J4 J5 J9 = CMP-2000-05152-3: CONN U.FL RCPT STR 50 OHM SMD; Max Frequency: 6GHz; Connector Type: Coaxial; Body Plating: Silver; Body Material: Bronze; Impedance: 50R; Dielectric Material: Polymer; Insulation Resistance: 500MR; Gender: Male; Packaging: Cut Tape; Length: 3mm; Package Quantity: 2500; Termination: Solder; Lead Free: Lead Free; Series: U.FL; Min Operating Temperature: -40°C; Fastening Type: Snap; Contact Material: Brass; Orientation: Straight; Wire/Cable Type: Coaxial; Frequency: 6GHz; Contact Plating: Gold; Depth: 3.1mm; Weight: 0.001764oz; Max Operating Temperature: 90°C; Radiation Hardening: No; REACH SVHC: No SVHC; Mount: Surface Mount; Housing Color: Beige
J2 = PBD-10_1: Connector; Manufacturer: Connfly; Part Number1: DS-1023-2x5; Part Number: PBD-10; System: Connector
J6 J7 = BM23FR0.8-10DS-0.35V_895_: Connector; Manufacturer_Name: Hirose; Manufacturer_Part_Number: BM23FR0.8-10DS-0.35V(895); Datasheet Link: https://componentsearchengine.com/Datasheets/1/BM23FR0.8-10DS-0.35V(895).pdf; Height: 0.9mm; Mouser Part Number: 798-3FR0810DS035V895; Mouser Price/Stock: https://www.mouser.co.uk/ProductDetail/Hirose-Connector/BM23FR08-10DS-035V895/?qs=YCa%2FAAYMW01IXWgIGURT8A%3D%3D
R3 = CMP-2002-03046-1: Part Number: CRCW040210R0FKEDHP; Manufacturer: Vishay Dale
R4 R5 = CMP-1659-00036-1: General Purpose Chip Resistor, 49.9 Ohm, +/- 1%, -55 to 155 degC, 0603 (1608 Metric), RoHS, Tape and Reel; Max Supply Voltage: 3.63 V; Case\Package: LQFP; Interface: SPI; Min Supply Voltage: 2.97 V; PackageReference: 0603; Packaging: Tray; ComponentLink2Description: Datasheet; ComponentLink1Description: Manufacturer URL; ComponentLink2URL: https://datasheet.ciiva.com/11808/0900766b80f96399-11808223.pdf; RoHSCompliant: true; Max Operating Temperature: 85 degC; ComponentLink1URL: http://www.yageo.com/; PackageDescription: 2-Pin Surface Mount Device, Body 1.6 x 0.8 mm; DatasheetVersion: Rev. 4, 04/2009; Min Operating Temperature: -40 degC; Package Quantity: 250; Pins: 48

## Sheet GNSS.SchDoc
size C; SheetNumber: 4; SheetTotal: 4
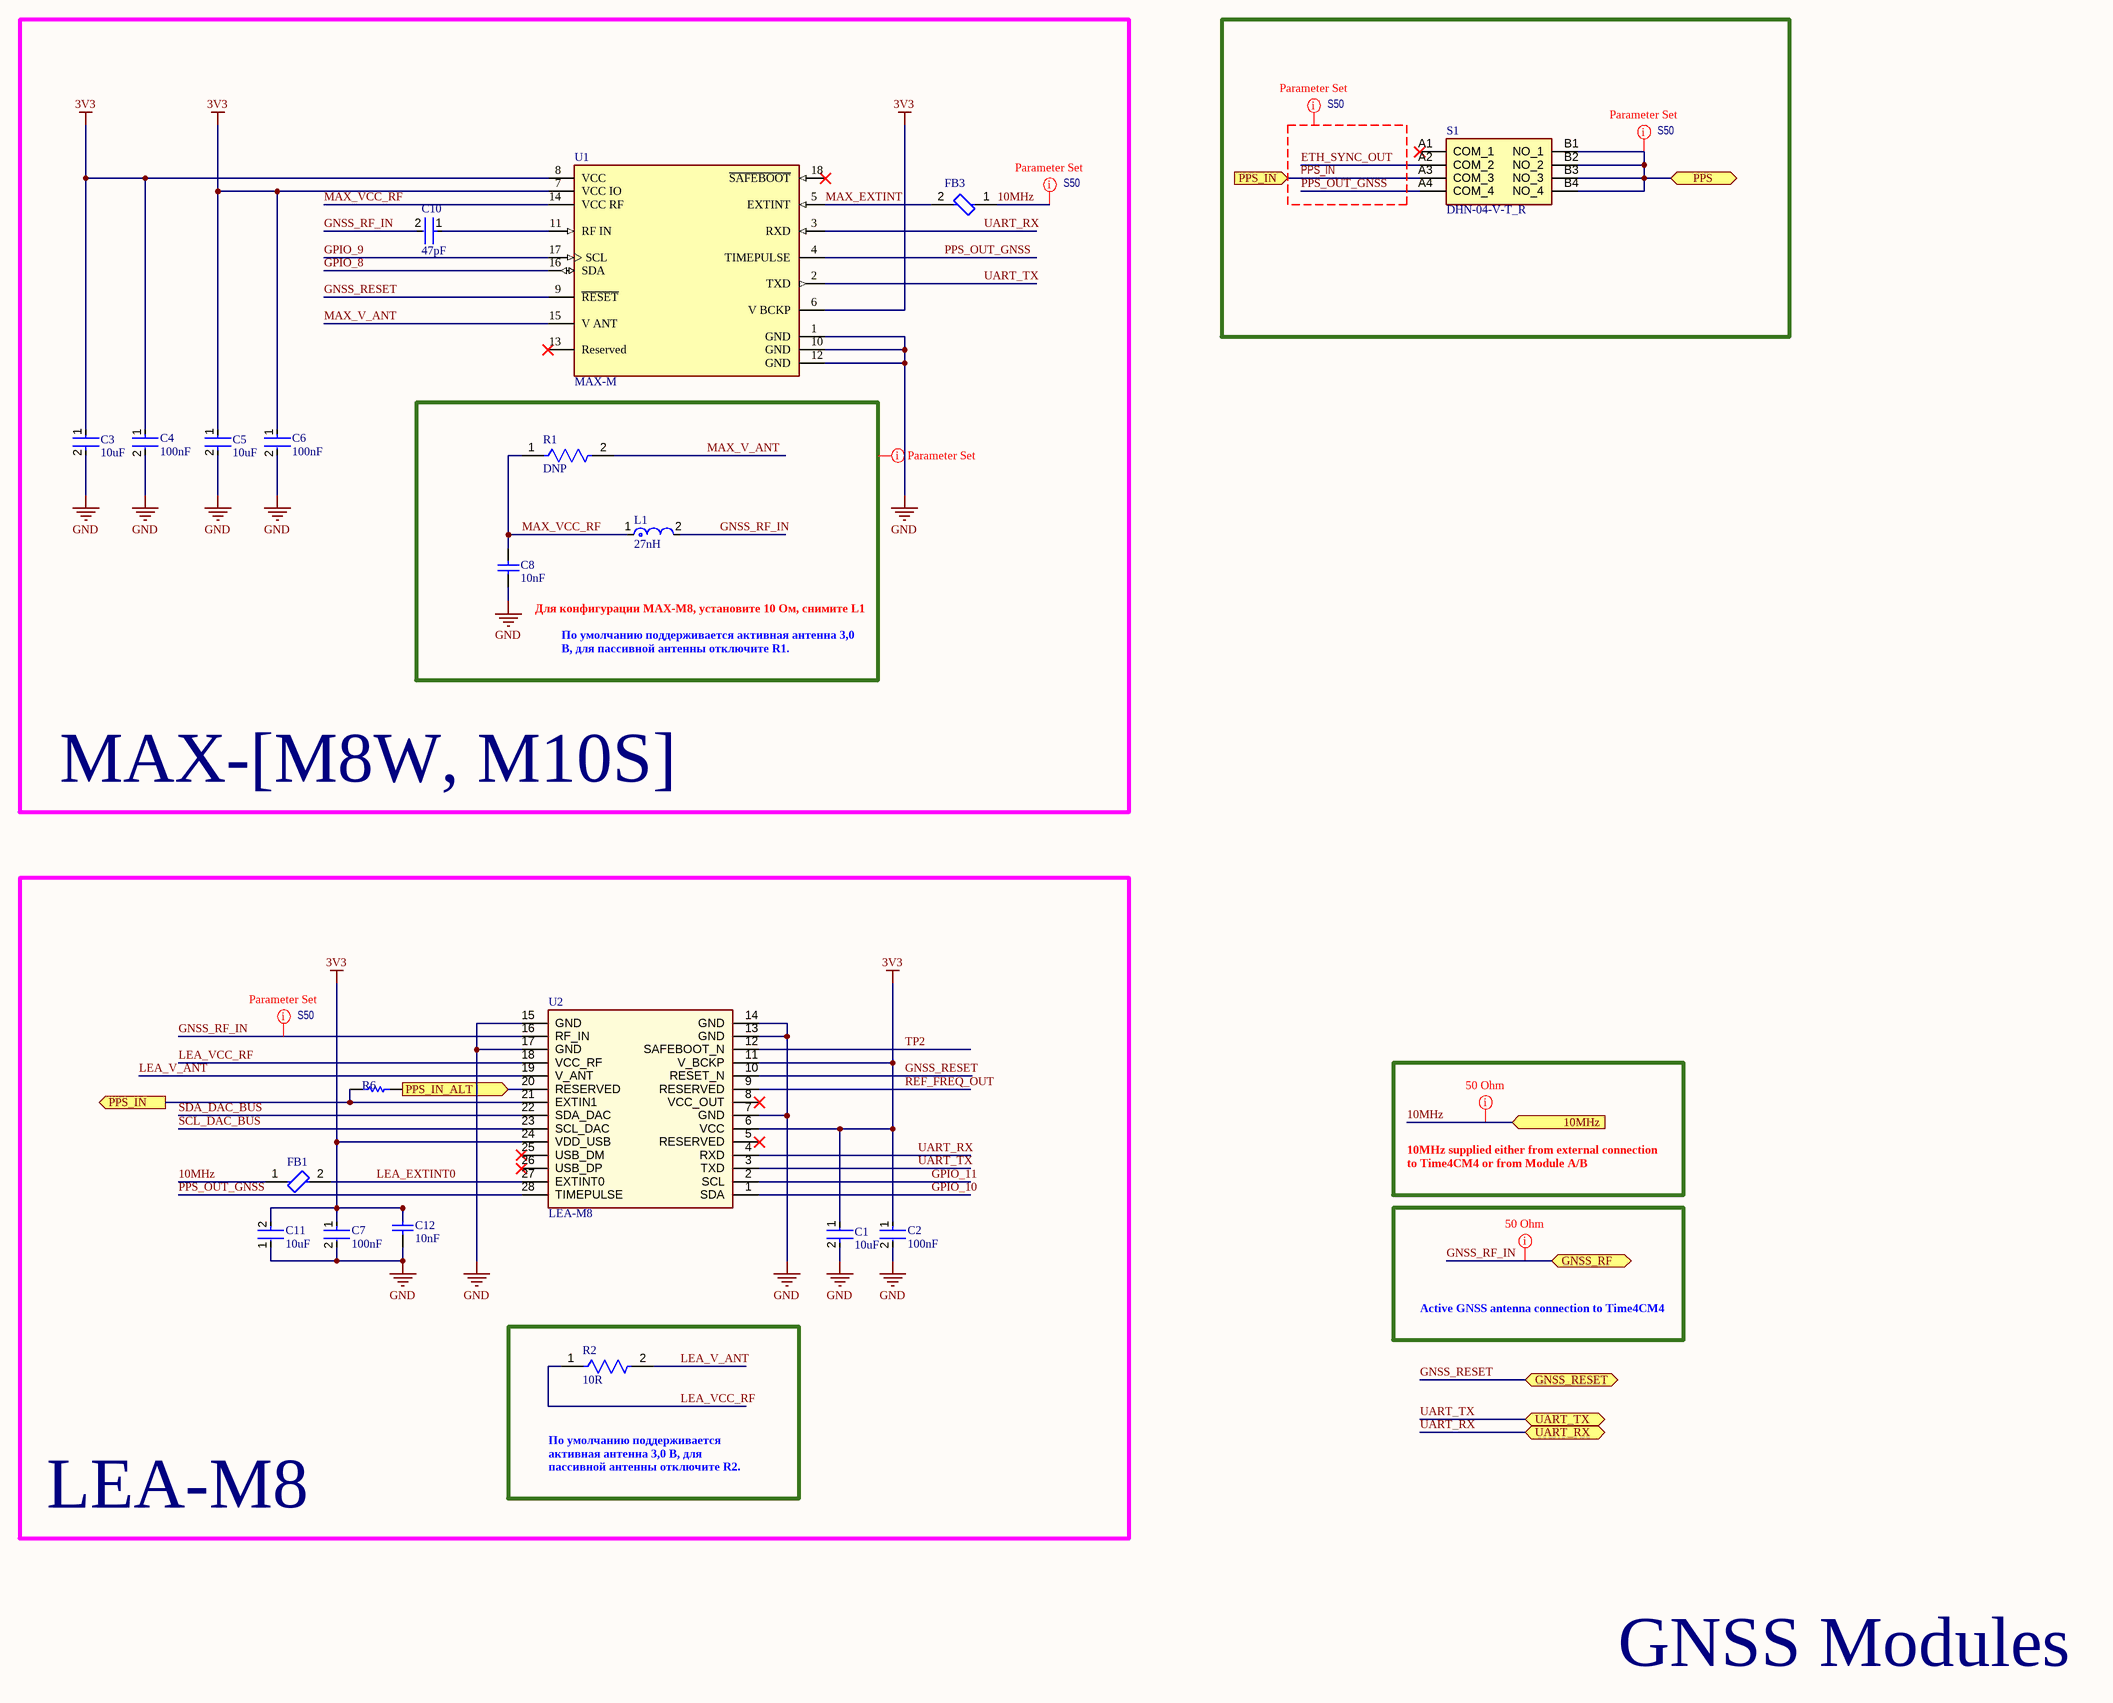
[diagram p5: GNSS.SchDoc]

### Parts
C1  10uF  [FP-C1608-080-0_1-IPC_A]
C2  100nF  [FP-C0603C-CF-MFG]
C3  10uF  [FP-C1608-080-0_1-IPC_A]
C4  100nF  [FP-C0603C-CF-MFG]
C5  10uF  [FP-C1608-080-0_1-IPC_A]
C6  100nF  [FP-C0603C-CF-MFG]
C7  100nF  [FP-C0603C-CF-MFG]
C8  10nF  [CAPC1608X90X35LL15T15]
C10  47pF  [FP-C0402-BB-MFG]
C11  10uF  [FP-C1608-080-0_1-MFG]
C12  10nF  [CAPC1608X90X35LL15T15]
FB1  BLM18HG102SH1D  [FP-BLM18-0_15-t0_8-IPC_C]  (value not drawn)
FB3  BLM18HG102SH1D  [FP-BLM18-0_15-t0_8-IPC_C]  (value not drawn)
L1  27nH  [FP-LQG15HH_02-IPC_C]
R1  DNP  [FP-ERJ3EK-MFG]
R2  10R  [FP-ERJ3EK-MFG]
R6  0R  [RESC1608X55X25ML10T15]  (value not drawn)
S1  DHN-04-V-T_R  [DHN04VTR]
U1  MAX-M  [FP-MAX-M8W-0-MFG]
U2  LEA-M8  [LEA]

### Blocks framed on the sheet
MAX-[M8W, M10S]: C3-C6 C8 C10 FB3 L1 R1 U1
LEA-M8: C1 C2 C7 C11 C12 FB1 R2 R6 U2

### Ports
10MHz (in), GNSS_RESET (bidir), GNSS_RF (bidir), PPS (bidir), PPS_IN (in), PPS_IN (out), PPS_IN_ALT (in), UART_RX (bidir), UART_TX (bidir)

### Nets
3V3: C1.1 C2.1 C3.1 C4.1 C5.1 C6.1 C7.1 C11.2 C12.2 U1.6(V_BCKP) U1.7(VCC_IO) U1.8(VCC) U2.6(VCC) U2.11(V_BCKP) U2.24(VDD_USB)
GND: C1.2 C2.2 C3.2 C4.2 C5.2 C6.2 C7.2 C8.1 C11.1 C12.1 U1.1(GND) U1.10(GND) U1.12(GND) U2.7(GND) U2.13(GND) U2.14(GND) U2.15(GND) U2.17(GND)
10MHz: FB1.1 FB3.1 ; port 10MHz
ETH_SYNC_OUT: S1.A2(COM_2)
GNSS_RESET: U1.9(~{RESET}) U2.10(RESET_N) ; port GNSS_RESET
GNSS_RF_IN: C10.2 L1.2 U2.16(RF_IN) ; port GNSS_RF
GPIO_8: U1.16(SDA)
GPIO_9: U1.17(SCL)
GPIO_10: U2.1(SDA)
GPIO_11: U2.2(SCL)
LEA_EXTINT0: FB1.2 U2.27(EXTINT0)
LEA_V_ANT: R2.2 U2.19(V_ANT)
LEA_VCC_RF: R2.1 U2.18(VCC_RF)
MAX_EXTINT: FB3.2 U1.5(EXTINT)
MAX_V_ANT: R1.2 U1.15(V_ANT)
MAX_VCC_RF: C8.2 L1.1 R1.1 U1.14(VCC_RF)
PPS: S1.B1(NO_1) S1.B2(NO_2) S1.B3(NO_3) S1.B4(NO_4) ; port PPS
PPS_IN: R6.1 S1.A3(COM_3) U2.21(EXTIN1) ; port PPS_IN
PPS_IN_ALT: R6.2 U2.20(RESERVED) ; port PPS_IN_ALT
PPS_OUT_GNSS: S1.A4(COM_4) U1.4(TIMEPULSE) U2.28(TIMEPULSE)
REF_FREQ_OUT: U2.9(RESERVED)
SCL_DAC_BUS: U2.23(SCL_DAC)
SDA_DAC_BUS: U2.22(SDA_DAC)
TP2: U2.12(SAFEBOOT_N)
UART_RX: U1.3(RXD) U2.4(RXD) ; port UART_RX
UART_TX: U1.2(TXD) U2.3(TXD) ; port UART_TX
NetC10_1: C10.1 U1.11(RF_IN)

Not connected (* = marked no-connect by the designer): S1 A1(COM_1)*; U1 13(Reserved)* 18(~{SAFEBOOT})*; U2 5(RESERVED)* 8(VCC_OUT)* 25(USB_DM)* 26(USB_DP)*

### Layout directives
net class RF: 10MHz, GNSS_RF_IN
net class S50: 10MHz, ETH_SYNC_OUT, GNSS_RF_IN, PPS, PPS_IN, PPS_OUT_GNSS

### Notes on the sheet
- (near C8) Для конфигурации MAX-M8, установите 10 Ом, снимите L1
- По умолчанию поддерживается активная антенна 3,0 В, для пассивной антенны отключите R1.
- 10MHz supplied either from external connection to Time4CM4 or from Module A/B
- Active GNSS antenna connection to Time4CM4
- По умолчанию поддерживается активная антенна 3,0 В, для пассивной антенны отключите R2.
- GNSS Modules
- DWG. NO.
- REV.
- SHT.
- REVISION
- DESCRIPTION
- DATE
- APPROVED
- THIS DOCUMENT AND THE DATA DISCLOSED HEREIN OR HEREWITH IS THE PROPERTY OF ALTIUM LIMITED AND MAY BE FREELY DISTRIBUTED IN WHOLE. NO RIGHTS ARE RESERVED OR EXPRESS OR IMPLIED WARANTEE GIVEN.
- ENG:
- DSN:
- APPROVALS
- PROJECT
- DOCUMENT REVISION:
- DESIGN ITEM:
- CHK:
- BOM:
- REFERENCE DOCUMENTS
- PROJECT REVISION:
- TITLE
- FAB DWG:
- PCB DWG:
- ASSY DWG:
- SCALE:
- SIZE
- C
- CAGE CODE
- FILE NAME
- DWG NO.
- SHEET
- OF
- REV

### Library data of the parts
C1 C3 C5 C11 = CMP-2000-04979-3: Multilayer Ceramic Capacitors 10μF ±10% 10V X5R SMD 0603; Dielectric Material: Ceramic; Construction: Flat; Height: 0.8mm; Thickness: 0.035inch; Case Code (Metric): 1608; Radiation Hardening: No; Number of Pins: 2; Voltage Rating (DC): 10V; Depth: 0.8mm; Voltage: 10V; RoHS Compliant: Yes; Voltage Rating: 10V; Package Quantity: 1; Resistor Type: Ceramic; Termination: SMD/SMT; Lead Free: Lead Free; REACH SVHC: No SVHC; Tolerance: 10%; Mount: Surface Mount; Series: C; Packaging: Tape and Reel; Width: 0.8mm; Dielectric: X5R; Weight: 7.1E-05oz; Length: 1.6mm; Max Operating Temperature: 85°C; Case Code (Imperial): 0603; Case/Package: 0603; Min Operating Temperature: -55°C; Capacitance: 10uF
C2 C4 C6 C7 = CMP-2006-03068-2: as C9 on sheet Modular_BO; Temperature Range High: +125°C; Voltage Rating: 50 V; Device Class L3: Ceramic Capacitors; Height: 0.87mm; Category: Cap; RoHS: TRUE; Digikey Description: CAP CER 0.1UF 50V 20% X7R 0603; ComponentLink2URL: https://api.kemet.com/component-edge/download/datasheet/C0603C100J5GACAUTO.pdf; Lead Free: Yes; Temperature Range Low: -55°C; Device Class L1: Passive Components; ComponentLink2Description: Datasheet; Temperature Characteristic: X7R; Automotive: Yes; Temperature: -55°C to +125°C; Octopart: https://octopart.com/c0603c104m5ractu-kemet-11855687; Device Class L2: Capacitors; Package: C0603C-CF; Mouser Description: Multilayer Ceramic Capacitors MLCC - SMD/SMT 50volts 0.1uF X7R 20%; Capacitance: 0.10 μF
C8 = CMP-2006-02059-1: Multilayer Ceramic Capacitor, 0.01 uF, 16 V, ± 10%, X7R, 0603 [1608 Metric]; Manufacturer: AVX Interconnect / Elco; Part Number: 0603YC103KAT2A; Voltage Rating (DC): 16V; Dissipation Factor: 3.5%; Supplier 1: Arrow Electronics; Supplier Part Number 1: 0603YC103KAT2A; Manufacturer Part Number: 0603YC103KAT2A; RoHS: Yes; Category: Ceramic Capacitors; Stock 1: 910956; Pricing 1: 4000=0.02200, 8000=0.02060, 12000=0.01980, 20000=0.01970, 24000=0.01700, 100000=0.01460 (USD); Mount: Surface Mount; Case/Package: 0603; Case Code (Metric): 1608; Case Code (Imperial): 0603; Min Operating Temperature: -55°C; Max Operating Temperature: 125°C; Capacitance: 10nF; Tolerance: 10%; Dielectric: X7R; Packaging: Tape and Reel; Voltage Rating: 16V; Package Quantity: 1; Termination: SMD/SMT; Voltage: 16V; Series: -; Construction: Flat; Length: 1.6mm; Width: 0.032inch; Depth: 0.81mm; Thickness: 0.035inch; Radiation Hardening: No; REACH SVHC: No SVHC; Lead Free: Lead Free; RoHS Compliant: Yes; ComponentLink1URL: https://datasheet.ciiva.com/150/cx7r-150743.pdf?src-supplier=Digi-Key; ComponentLink1Description: https://datasheet.ciiva.com/150/cx7r-150743.pdf?src-supplier=Digi-Key; ComponentLink2URL: https://datasheet.ciiva.com/150/cx7r-150744.pdf?src-supplier=Digi-Key; ComponentLink2Description: https://datasheet.ciiva.com/150/cx7r-150744.pdf?src-supplier=Digi-Key; ComponentLink3URL: https://datasheet.ciiva.com/150/cx7r-150745.pdf?src-supplier=Digi-Key; ComponentLink3Description: https://datasheet.ciiva.com/150/cx7r-150745.pdf?src-supplier=Digi-Key; ComponentLink4URL: https://datasheet.ciiva.com/5412/cx7r-218113-5412060.pdf?src-supplier=Mouser; ComponentLink4Description: https://datasheet.ciiva.com/5412/cx7r-218113-5412060.pdf?src-supplier=Mouser; ComponentLink5URL: https://datasheet.ciiva.com/16375/cx7r-16375919.pdf?src-supplier=Future+Electronics; ComponentLink5Description: https://datasheet.ciiva.com/16375/cx7r-16375919.pdf?src-supplier=Future+Electronics; ComponentLink6URL: https://datasheet.ciiva.com/7855/1679506-7855103.pdf?src-supplier=Element14; ComponentLink6Description: https://datasheet.ciiva.com/7855/1679506-7855103.pdf?src-supplier=Element14; ComponentLink7URL: https://datasheet.ciiva.com/22683/1679506-22683367.pdf?src-supplier=Element14; ComponentLink7Description: https://datasheet.ciiva.com/22683/1679506-22683367.pdf?src-supplier=Element14; ComponentLink8URL: https://datasheet.ciiva.com/22699/1679506-22699610.pdf?src-supplier=Element14; ComponentLink8Description: https://datasheet.ciiva.com/22699/1679506-22699610.pdf?src-supplier=Element14
C10 = CMP-2008-03364-2: CAP CER 47PF 25V 5% NP0 0402; Manufacturer Part Number: C0402C470J3GACTU; Manufacturer: Kemet; Material: Ceramic; Temperature Coefficient: 15%; Temperature Characteristic: C0G; Tolerance: 0.05; RoHS: TRUE; Category: Cap; Device Class L1: Passive Components; Device Class L3: Ceramic Capacitors; Voltage Rating: 25 V; Automotive: No; Octopart: https://octopart.com/c0402c470j3gactu-kemet-9139794; Value: 47 pF; Package: C0402-BB; Temperature: -55°C to +125°C; Mouser Description: Multilayer Ceramic Capacitors MLCC - SMD/SMT 25volts 47pF C0G 5%; Temperature Range Low: -55°C; Temperature Range High: +125°C; Lead Free: Yes; Capacitance: 47 pF; Digikey Description: CAP CER 47PF 25V 5% NP0 0402; Device Class L2: Capacitors; ComponentLink2URL: https://content.kemet.com/datasheets/KEM_C1002_X7R_SMD.pdf; Height: 0.55mm; ComponentLink2Description: Datasheet; Ipc Land Pattern Name: CAPC10050X50
C12 = CMP-2006-02059-1: Manufacturer: AVX Interconnect / Elco; Part Number: 0603YC103KAT2A
FB1 FB3 = CMP-06046-001255-1: Chip Ferrite Bead, 0603, 1000Ω @ 100MHz, 1.6Ω, 25%, 100mA; Number of Circuits: 1; DC Resistance (DCR): 1.6R; Shielding: Unshielded; Impedance: 1kR; Max Current Rating: 100mA; Case Code (Metric): 1608; Number of Lines: 1; Ratings: AEC-Q200; Test Frequency: 100MHz; Case Code (Imperial): 0603; Min Operating Temperature: -55°C; Height: 0.037inch; Contact Plating: Tin; Package Quantity: 4000; Width: 0.8mm; Packaging: Tape and Reel; Mount: Surface Mount; Case/Package: 0603; Max Operating Temperature: 125°C; Length: 1.6mm; Max DC Current: 100mA; Tolerance: 25%; Termination: SMD/SMT
L1 = CMP-2000-06578-2: Multilayer type RF Inductor 27nH ±5% 0.46Ω 350mA 0402; DC Current: 300mA; Core Material: Air; Self Resonant Frequency: 1.7GHz; Q Factor: 8; DC Resistance (DCR): 460mR; Shielding: Unshielded; Test Frequency: 100MHz; Inductance: 27nH; Width: 0.02inch; Length: 1mm; Height - Seated (Max): 0.022inch; Military Standard: Not; Case Code (Imperial): 0402; Tolerance: 5%; Depth: 0.55mm; Current Rating: 300mA; Inductance Tolerance: 5%; Lead Free: Lead Free; Height: 0.5mm; Max DC Current: 300mA; REACH SVHC: No SVHC; Package Quantity: 10000; Mount: Surface Mount; Termination: SMD/SMT; Case Code (Metric): 1005; Case/Package: 0402; Max Operating Temperature: 125°C; Packaging: Tape and Reel; Min Operating Temperature: -55°C
R1 R2 = CMP-2000-00195-2: RES SMD 10 OHM 1% 1/10W 0603; Manufacturer Part Number: ERJ-3EKF10R0V; Manufacturer: Panasonic; Resistance: 10Ω; Voltage Rating: 75V; Value: 10Ω; Power: 100mW; Power Rating: 0.1W; Temperature Coefficient: 100ppm/°C; Automotive Grade: Grade 0; Lead Free: Yes; Device Class L1: Passive Components; Digikey Description: RES SMD 10 OHM 1% 1/10W 0603; Octopart: https://octopart.com/erj-3ekf10r0v-panasonic-55403649; Automotive: Yes; ComponentLink2URL: https://b2b-api.panasonic.eu/file_stream/pids/fileversion/1263; Height: 0.55mm; Temperature Range High: +155°C; Footprint Url: https://industrial.panasonic.com/cdbs/www-data/pdf/RDA0000/DMA0000COL17.pdf; Temperature: -55°C to +155°C; Tolerance: 1%; ComponentLink2Description: Datasheet; Package: ERJ3EK; Device Class L2: Resistors; Category: Res; Ipc Land Pattern Name: RESC16080X45; RoHS: TRUE; Composition: Thick Film; Device Class L3: Chip SMD Resistors; Temperature Range Low: -55°C; Series: ERJ
R6 = CMP-2100-03667-1: Chip Resistor, 0 Ohm, +/- 5%, 0.1 W, -55 to 155 degC, 0603 (1608 Metric), RoHS, Tape and Reel; Manufacturer: Yageo; Temperature Coefficient: 200ppm/degreesC; Voltage Rating: 50V; Power Rating: 100mW; Resistance: 0mOhm; Width: 0.8mm; Max Operating Temperature: 155degC; Tolerance: 5%; Package Reference: 0603; Height: 0.45mm; Depth: 0.8mm; Package Description: 2-Pin Surface Mount Device, Body 1.6 x 0.8 mm; Termination: SMD/SMT; Package Quantity: 5000; Case/Package: 0603; Case Code (Imperial): 0603; Radiation Hardening: No; Number of Pins: 2; Length: 1.6mm; Lead Free: LeadFree; Voltage Rating (DC): 50V; Military Standard: Not; Datasheet URL: http://www.yageo.com/NewPortal/yageodocoutput?fileName=/pdf/R-Chip/PYu-RC_Group_51_RoHS_L_5.pdf; Manufacturer URL: http://www.yageo.com/; Packaging: TapeandReel; Case Code (Metric): 1608; Min Operating Temperature: -55degC; Composition: ThickFilm; RoHSCompliant: true; Contact Plating: Tin; Datasheet Version: Rev. 5, 10/2016; REACH SVHC: NoSVHC
S1 = DHN-04-V-T_R: Switch; Manufacturer_Name: Diptronics; Manufacturer_Part_Number: DHN-04-V-T/R; Datasheet Link: https://datasheet.lcsc.com/lcsc/1809172046_Diptronics-DHN-04-V-T-R_C224996.pdf; Height: 1.65mm; Mouser Part Number: 113-DHN04VTR; Mouser Price/Stock: https://www.mouser.co.uk/ProductDetail/Diptronics/DHN-04-V-T-R?qs=MLItCLRbWszy0w3dgyiNuw%3D%3D
U1 = CMP-207130-000023-1: RF RCVR GNSS/GPS 1.575GHZ 18LCC; Current - Receiving: 23mA; Interface: I2C; Sensitivity: -167dBm; Frequency: 1.575GHz; Min Operating Temperature: -40°C; Packaging: Tape and Reel; RoHS Compliant: Yes; Max Operating Temperature: 85°C; Case/Package: SMD/SMT
U2 = LEA: u-blox LEA GNSS module; Part Description: u-blox LEA-M8 GNSS module; Manufacturer: u-blox; Value: LEA-M8

## Nets that join several sheets
1V8: CM4_Conn (CM4.88 CM4.90), CM4_IO_Conn (CM1.88 CM1.90), Modular_BO (J6.5)
3V3: CM4_Conn (CM4.84 CM4.86), CM4_IO_Conn (CM1.84 CM1.86), Modular_BO (6 pins), GNSS (15 pins)
5V: CM4_Conn (6 pins), CM4_IO_Conn (6 pins), Modular_BO (J6.7)
GND: CM4_Conn (50 pins), CM4_IO_Conn (50 pins), Modular_BO (24 pins), GNSS (18 pins)
10MHz: Modular_BO (J2.1 J4.1 J7.1), GNSS (FB1.1 FB3.1)
ANAIP_0: CM4_Conn (CM4.96), CM4_IO_Conn (CM1.96)
ANAIP_1: CM4_Conn (CM4.94), CM4_IO_Conn (CM1.94)
BT_DIS: CM4_Conn (CM4.91), CM4_IO_Conn (CM1.91)
CM0_C_N: CM4_Conn (CM4.140), CM4_IO_Conn (CM1.140)
CM0_C_P: CM4_Conn (CM4.142), CM4_IO_Conn (CM1.142)
CM0_D0_N: CM4_Conn (CM4.128), CM4_IO_Conn (CM1.128)
CM0_D0_P: CM4_Conn (CM4.130), CM4_IO_Conn (CM1.130)
CM0_D1_N: CM4_Conn (CM4.134), CM4_IO_Conn (CM1.134)
CM0_D1_P: CM4_Conn (CM4.136), CM4_IO_Conn (CM1.136)
CM1_C_N: CM4_Conn (CM4.127), CM4_IO_Conn (CM1.127)
CM1_C_P: CM4_Conn (CM4.129), CM4_IO_Conn (CM1.129)
CM1_D0_N: CM4_Conn (CM4.115), CM4_IO_Conn (CM1.115)
CM1_D0_P: CM4_Conn (CM4.117), CM4_IO_Conn (CM1.117)
CM1_D1_N: CM4_Conn (CM4.121), CM4_IO_Conn (CM1.121)
CM1_D1_P: CM4_Conn (CM4.123), CM4_IO_Conn (CM1.123)
CM1_D2_N: CM4_Conn (CM4.133), CM4_IO_Conn (CM1.133)
CM1_D2_P: CM4_Conn (CM4.135), CM4_IO_Conn (CM1.135)
CM1_D3_N: CM4_Conn (CM4.139), CM4_IO_Conn (CM1.139)
CM1_D3_P: CM4_Conn (CM4.141), CM4_IO_Conn (CM1.141)
CM_GPIOx: CM4_Conn (CM4.97), CM4_IO_Conn (CM1.97)
DSI0_C_N: CM4_Conn (CM4.169), CM4_IO_Conn (CM1.169)
DSI0_C_P: CM4_Conn (CM4.171), CM4_IO_Conn (CM1.171)
DSI0_D0_N: CM4_Conn (CM4.157), CM4_IO_Conn (CM1.157)
DSI0_D0_P: CM4_Conn (CM4.159), CM4_IO_Conn (CM1.159)
DSI0_D1_N: CM4_Conn (CM4.163), CM4_IO_Conn (CM1.163)
DSI0_D1_P: CM4_Conn (CM4.165), CM4_IO_Conn (CM1.165)
DSI1_C_N: CM4_Conn (CM4.187), CM4_IO_Conn (CM1.187)
DSI1_C_P: CM4_Conn (CM4.189), CM4_IO_Conn (CM1.189)
DSI1_D0_N: CM4_Conn (CM4.175), CM4_IO_Conn (CM1.175)
DSI1_D0_P: CM4_Conn (CM4.177), CM4_IO_Conn (CM1.177)
DSI1_D1_N: CM4_Conn (CM4.181), CM4_IO_Conn (CM1.181)
DSI1_D1_P: CM4_Conn (CM4.183), CM4_IO_Conn (CM1.183)
DSI1_D2_N: CM4_Conn (CM4.193), CM4_IO_Conn (CM1.193)
DSI1_D2_P: CM4_Conn (CM4.195), CM4_IO_Conn (CM1.195)
DSI1_D3_N: CM4_Conn (CM4.194), CM4_IO_Conn (CM1.194)
DSI1_D3_P: CM4_Conn (CM4.196), CM4_IO_Conn (CM1.196)
ETH_LED1: CM4_Conn (CM4.19), CM4_IO_Conn (CM1.19)
ETH_LED2: CM4_Conn (CM4.17), CM4_IO_Conn (CM1.17)
ETH_LED3: CM4_Conn (CM4.15), CM4_IO_Conn (CM1.15)
ETH_PAIR0_N: CM4_Conn (CM4.10), CM4_IO_Conn (CM1.10)
ETH_PAIR0_P: CM4_Conn (CM4.12), CM4_IO_Conn (CM1.12)
ETH_PAIR1_N: CM4_Conn (CM4.6), CM4_IO_Conn (CM1.6)
ETH_PAIR1_P: CM4_Conn (CM4.4), CM4_IO_Conn (CM1.4)
ETH_PAIR2_N: CM4_Conn (CM4.9), CM4_IO_Conn (CM1.9)
ETH_PAIR2_P: CM4_Conn (CM4.11), CM4_IO_Conn (CM1.11)
ETH_PAIR3_N: CM4_Conn (CM4.5), CM4_IO_Conn (CM1.5)
ETH_PAIR3_P: CM4_Conn (CM4.3), CM4_IO_Conn (CM1.3)
ETH_SYNC_IN: CM4_Conn (CM4.16), CM4_IO_Conn (CM1.16)
ETH_SYNC_OUT: CM4_Conn (CM4.18), CM4_IO_Conn (CM1.18), GNSS (S1.A2)
GLOBAL_EN: CM4_Conn (CM4.99), CM4_IO_Conn (CM1.99)
GNSS_RESET: CM4_Conn (CM4.25), CM4_IO_Conn (CM1.25), GNSS (U1.9 U2.10)
GNSS_RF_IN: Modular_BO (J1.1), GNSS (C10.2 L1.2 U2.16)
GPIO_0: CM4_Conn (CM4.36), CM4_IO_Conn (CM1.36), Modular_BO (J7.3)
GPIO_1: CM4_Conn (CM4.35), CM4_IO_Conn (CM1.35), Modular_BO (J7.4)
GPIO_2: CM4_Conn (CM4.58), CM4_IO_Conn (CM1.58)
GPIO_3: CM4_Conn (CM4.56), CM4_IO_Conn (CM1.56)
GPIO_4: CM4_Conn (CM4.54), CM4_IO_Conn (CM1.54)
GPIO_5: CM4_Conn (CM4.34), CM4_IO_Conn (CM1.34)
GPIO_6: CM4_Conn (CM4.30), CM4_IO_Conn (CM1.30)
GPIO_7: CM4_Conn (CM4.37), CM4_IO_Conn (CM1.37)
GPIO_8: CM4_Conn (CM4.39), CM4_IO_Conn (CM1.39), GNSS (U1.16)
GPIO_9: CM4_Conn (CM4.40), CM4_IO_Conn (CM1.40), GNSS (U1.17)
GPIO_10: CM4_Conn (CM4.44), CM4_IO_Conn (CM1.44), GNSS (U2.1)
GPIO_11: CM4_Conn (CM4.38), CM4_IO_Conn (CM1.38), GNSS (U2.2)
GPIO_12: CM4_Conn (CM4.31), CM4_IO_Conn (CM1.31)
GPIO_13: CM4_Conn (CM4.28), CM4_IO_Conn (CM1.28)
GPIO_16: CM4_Conn (CM4.29), CM4_IO_Conn (CM1.29)
GPIO_17: CM4_Conn (CM4.50), CM4_IO_Conn (CM1.50), Modular_BO (J6.9)
GPIO_19: CM4_Conn (CM4.26), CM4_IO_Conn (CM1.26), Modular_BO (J6.8)
GPIO_20: CM4_Conn (CM4.27), CM4_IO_Conn (CM1.27)
GPIO_22: CM4_Conn (CM4.46), CM4_IO_Conn (CM1.46), Modular_BO (J6.10)
GPIO_23: CM4_Conn (CM4.47), CM4_IO_Conn (CM1.47)
GPIO_24: CM4_Conn (CM4.45), CM4_IO_Conn (CM1.45)
GPIO_25: CM4_Conn (CM4.41), CM4_IO_Conn (CM1.41)
GPIO_26: CM4_Conn (CM4.24), CM4_IO_Conn (CM1.24)
GPIO_27: CM4_Conn (CM4.48), CM4_IO_Conn (CM1.48)
GPIO_44: CM4_Conn (CM4.82), CM4_IO_Conn (CM1.82), Modular_BO (J7.5)
GPIO_45: CM4_Conn (CM4.80), CM4_IO_Conn (CM1.80), Modular_BO (J7.6)
GPIO_VREF: CM4_Conn (CM4.78), CM4_IO_Conn (CM1.78)
HDMI0_CEC: CM4_Conn (CM4.151), CM4_IO_Conn (CM1.151)
HDMI0_CLK_N: CM4_Conn (CM4.190), CM4_IO_Conn (CM1.190)
HDMI0_CLK_P: CM4_Conn (CM4.188), CM4_IO_Conn (CM1.188)
HDMI0_HP: CM4_Conn (CM4.153), CM4_IO_Conn (CM1.153)
HDMI0_SCL: CM4_Conn (CM4.200), CM4_IO_Conn (CM1.200)
HDMI0_SDA: CM4_Conn (CM4.199), CM4_IO_Conn (CM1.199)
HDMI0_TX0_N: CM4_Conn (CM4.184), CM4_IO_Conn (CM1.184)
HDMI0_TX0_P: CM4_Conn (CM4.182), CM4_IO_Conn (CM1.182)
HDMI0_TX1_N: CM4_Conn (CM4.178), CM4_IO_Conn (CM1.178)
HDMI0_TX1_P: CM4_Conn (CM4.176), CM4_IO_Conn (CM1.176)
HDMI0_TX2_N: CM4_Conn (CM4.172), CM4_IO_Conn (CM1.172)
HDMI0_TX2_P: CM4_Conn (CM4.170), CM4_IO_Conn (CM1.170)
HDMI1_CEC: CM4_Conn (CM4.149), CM4_IO_Conn (CM1.149)
HDMI1_CLK_N: CM4_Conn (CM4.166), CM4_IO_Conn (CM1.166)
HDMI1_CLK_P: CM4_Conn (CM4.164), CM4_IO_Conn (CM1.164)
HDMI1_HP: CM4_Conn (CM4.143), CM4_IO_Conn (CM1.143)
HDMI1_SCL: CM4_Conn (CM4.147), CM4_IO_Conn (CM1.147)
HDMI1_SDA: CM4_Conn (CM4.145), CM4_IO_Conn (CM1.145)
HDMI1_TX0_N: CM4_Conn (CM4.160), CM4_IO_Conn (CM1.160)
HDMI1_TX0_P: CM4_Conn (CM4.158), CM4_IO_Conn (CM1.158)
HDMI1_TX1_N: CM4_Conn (CM4.154), CM4_IO_Conn (CM1.154)
HDMI1_TX1_P: CM4_Conn (CM4.152), CM4_IO_Conn (CM1.152)
HDMI1_TX2_N: CM4_Conn (CM4.148), CM4_IO_Conn (CM1.148)
HDMI1_TX2_P: CM4_Conn (CM4.146), CM4_IO_Conn (CM1.146)
LED_ACT: CM4_Conn (CM4.21), CM4_IO_Conn (CM1.21)
LED_PWR: CM4_Conn (CM4.95), CM4_IO_Conn (CM1.95)
nEXTRST: CM4_Conn (CM4.100), CM4_IO_Conn (CM1.100)
nRPIBOOT: CM4_Conn (CM4.93), CM4_IO_Conn (CM1.93)
PCIe_CLK_N: CM4_Conn (CM4.112), CM4_IO_Conn (CM1.112)
PCIe_CLK_nREQ: CM4_Conn (CM4.102), CM4_IO_Conn (CM1.102)
PCIe_CLK_P: CM4_Conn (CM4.110), CM4_IO_Conn (CM1.110)
PCIe_nRST: CM4_Conn (CM4.109), CM4_IO_Conn (CM1.109)
PCIe_RX_N: CM4_Conn (CM4.118), CM4_IO_Conn (CM1.118)
PCIe_RX_P: CM4_Conn (CM4.116), CM4_IO_Conn (CM1.116)
PCIe_TX_N: CM4_Conn (CM4.124), CM4_IO_Conn (CM1.124)
PCIe_TX_P: CM4_Conn (CM4.122), CM4_IO_Conn (CM1.122)
PPS: Modular_BO (IC1.6 J2.8 J6.4), GNSS (S1.B1 S1.B2 S1.B3 S1.B4)
PPS_IN: Modular_BO (IC1.7 J2.4 J6.2), GNSS (R6.1 S1.A3 U2.21)
REF_FREQ_OUT: Modular_BO (J2.9 J7.10), GNSS (U2.9)
RUN_PG: CM4_Conn (CM4.92), CM4_IO_Conn (CM1.92)
SCL_DAC_BUS: Modular_BO (J2.5 J7.8), GNSS (U2.23)
SD_CLK: CM4_Conn (CM4.57), CM4_IO_Conn (CM1.57)
SD_CMD: CM4_Conn (CM4.62), CM4_IO_Conn (CM1.62)
SD_DAT0: CM4_Conn (CM4.63), CM4_IO_Conn (CM1.63)
SD_DAT1: CM4_Conn (CM4.67), CM4_IO_Conn (CM1.67)
SD_DAT2: CM4_Conn (CM4.69), CM4_IO_Conn (CM1.69)
SD_DAT3: CM4_Conn (CM4.61), CM4_IO_Conn (CM1.61)
SD_DAT4: CM4_Conn (CM4.68), CM4_IO_Conn (CM1.68)
SD_DAT5: CM4_Conn (CM4.64), CM4_IO_Conn (CM1.64)
SD_DAT6: CM4_Conn (CM4.72), CM4_IO_Conn (CM1.72)
SD_DAT7: CM4_Conn (CM4.70), CM4_IO_Conn (CM1.70)
SD_PWR_ON: CM4_Conn (CM4.75), CM4_IO_Conn (CM1.75)
SD_VDD_OR: CM4_Conn (CM4.73), CM4_IO_Conn (CM1.73)
SDA_DAC_BUS: Modular_BO (J2.3 J7.7), GNSS (U2.22)
TP2: Modular_BO (J2.7 J7.9), GNSS (U2.12)
UART_RX: CM4_Conn (CM4.55), CM4_IO_Conn (CM1.55), GNSS (U1.3 U2.4)
UART_TX: CM4_Conn (CM4.51), CM4_IO_Conn (CM1.51), GNSS (U1.2 U2.3)
USB_N: CM4_Conn (CM4.103), CM4_IO_Conn (CM1.103)
USB_OTG: CM4_Conn (CM4.101), CM4_IO_Conn (CM1.101)
USB_P: CM4_Conn (CM4.105), CM4_IO_Conn (CM1.105)
VDAC_COMP: CM4_Conn (CM4.111), CM4_IO_Conn (CM1.111)
WL_DIS: CM4_Conn (CM4.89), CM4_IO_Conn (CM1.89)